# Altium project Qunyin_mmWave_core.PrjPcb (part 1 of 2)
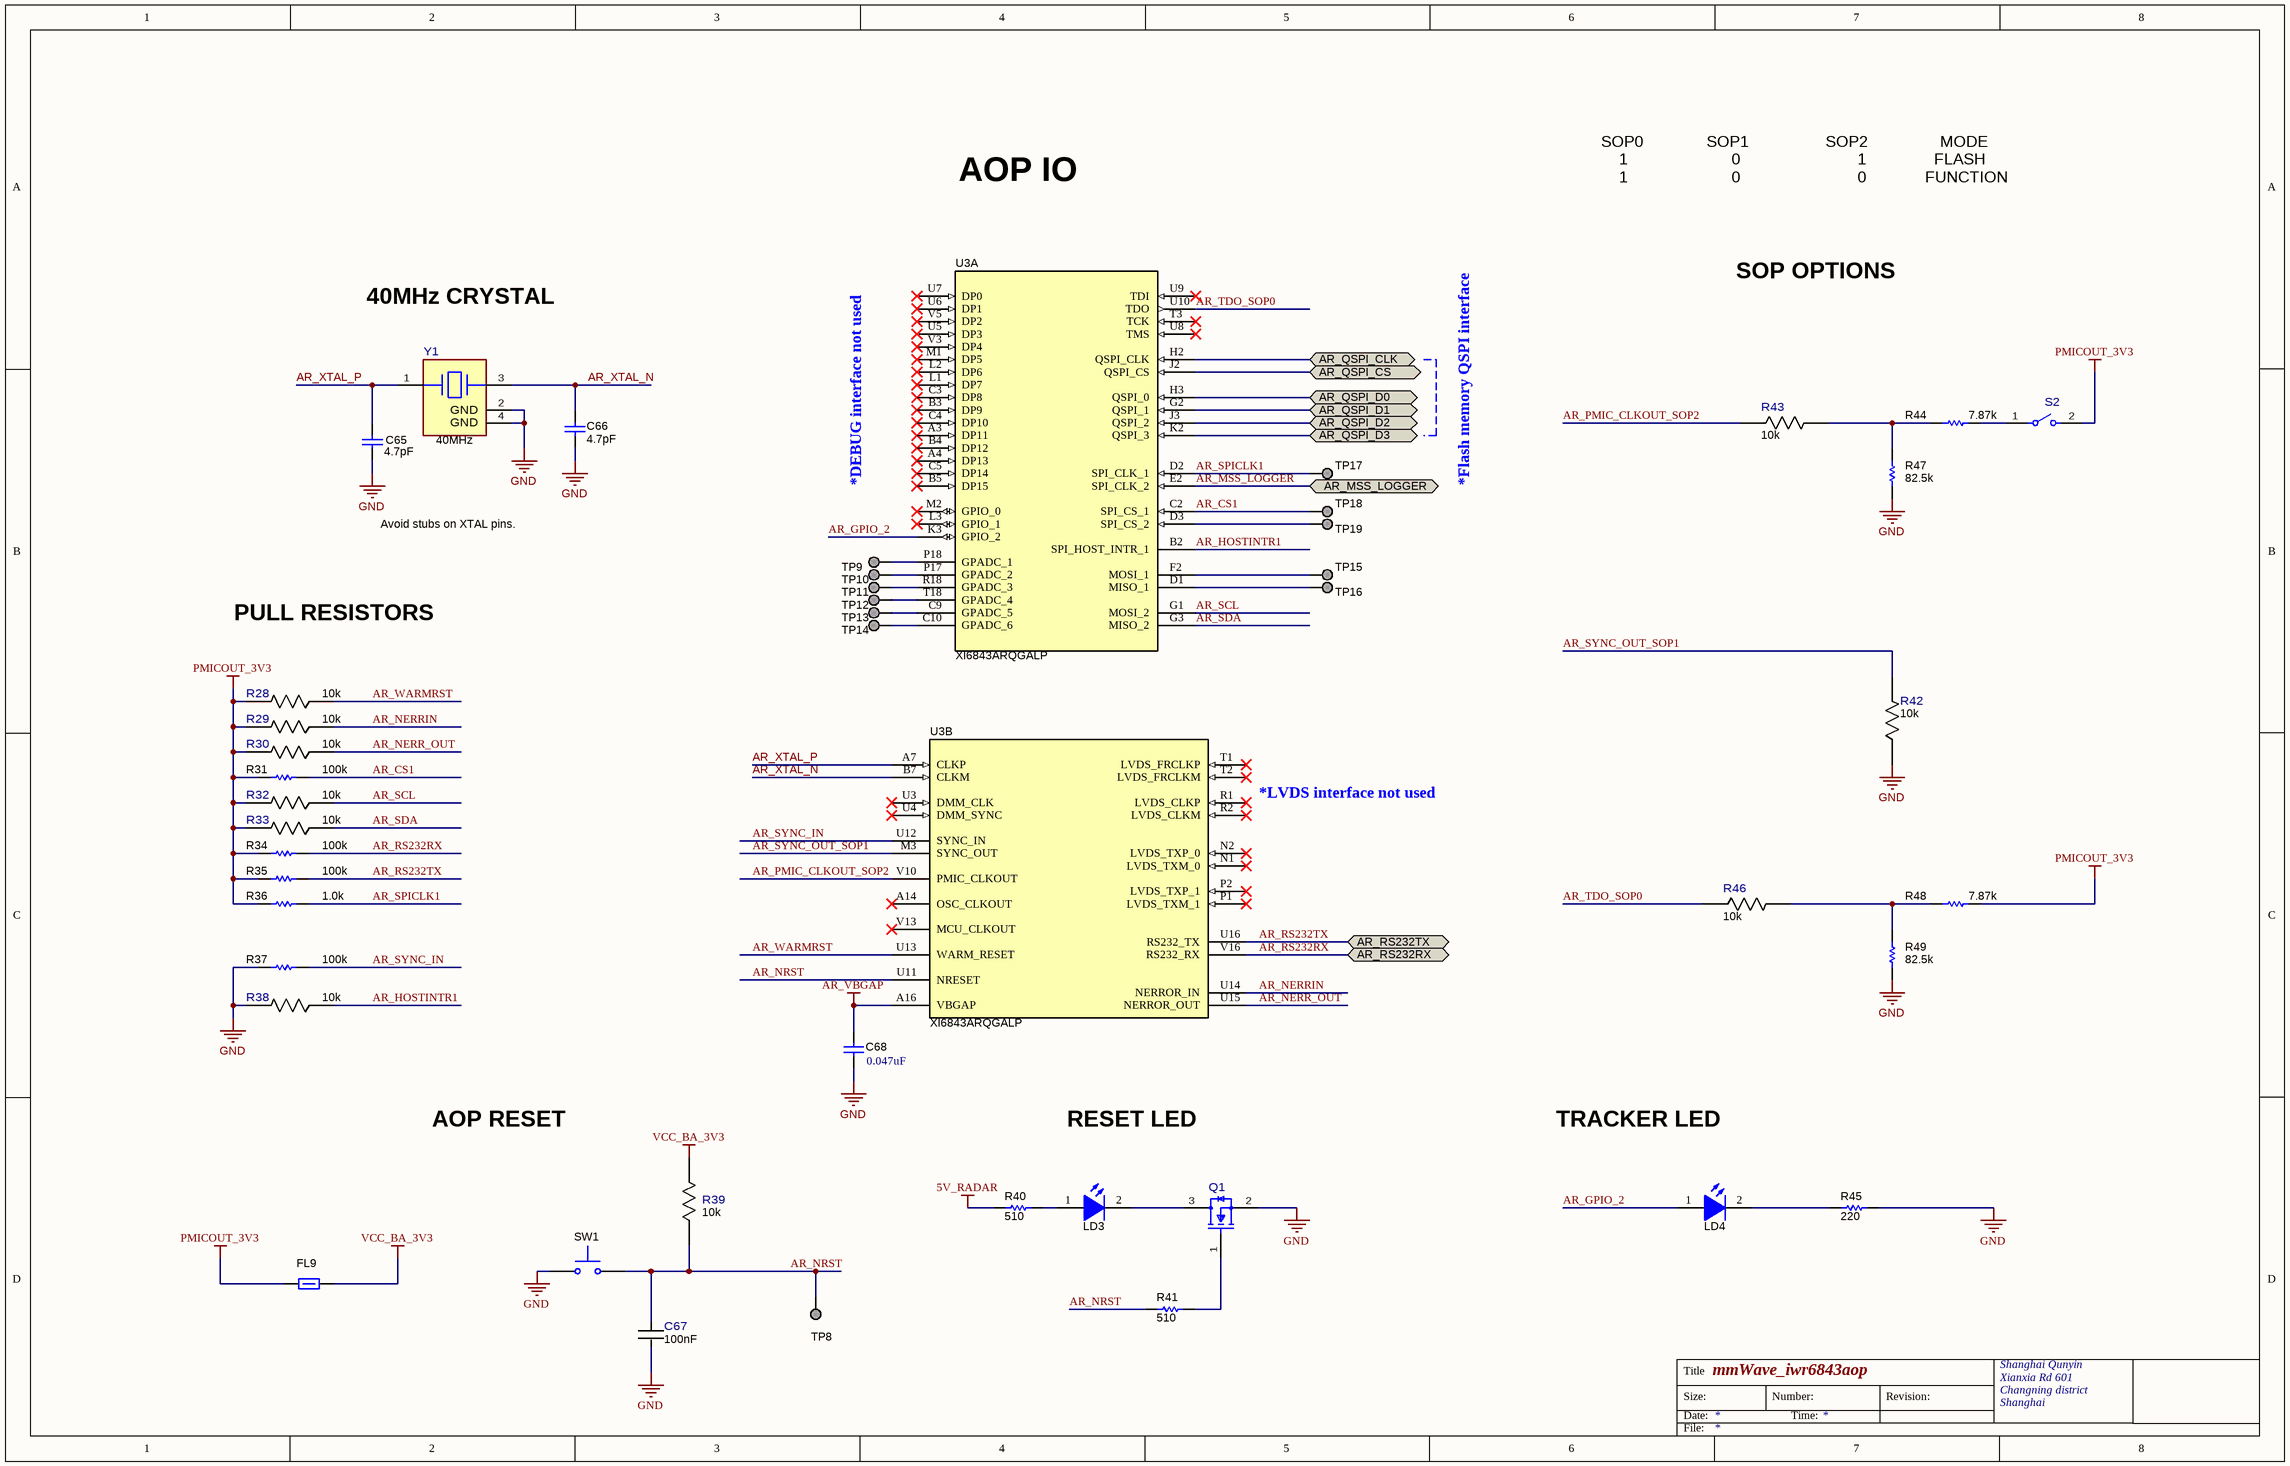
[diagram p0: Qunyin_mmWave_mainIOs.SchDoc]
5 sheets, 195 parts. Net scope: flat (ports and power ports of the same name join across sheets).
Sheets:
  Qunyin_mmWave_mainIOs.SchDoc
  Qunyin_mmWave_mainPowers.SchDoc
  Qunyin_mmWave_pmic.SchDoc
  Qunyin_mmWave_flash&USB.SchDoc
  Qunyin_mmWave_ESP32.SchDoc

## Sheet Qunyin_mmWave_mainIOs.SchDoc: mmWave_iwr6843aop
size 457 x 292 mm; DrawnBy: Wxd; Organization: Shanghai Qunyin; Address1: Xianxia Rd 601; Address2: Changning district; Address3: Shanghai; DocumentNumber: 1; SheetNumber: 1; SheetTotal: 5

### Parts
C65  value 4.7pF  [0201_033L]  (hidden comment: GRM0335C1H4R7BA01D)
C66  value 4.7pF  [0201_033L]  (hidden comment: GRM0335C1H4R7BA01D)
C67  Cap_F: 100nF  [FP-GRM033R6YA104KE14D_0201 (0603 Metric)-IPC_C]  (hidden comment: GRM033R6YA104KE14D)
C68  ValueDisplayed: 0.047uF  [0201_033L]  (hidden comment: GRM033R61C473KE84D)
FL9  BLM15PD300SZ1D  [0402L]  (value not drawn)
LD3  APHHS1005CGCK  [APHHS1005_Green]  (value not drawn)
LD4  APHHS1005CGCK  [APHHS1005_Green]  (value not drawn)
Q1  BSS123-7-F  [FP-BSS123-7-F_SOT23-IPC_C]  (value not drawn)
R28  Res_ohm: 10k  [FP-RR0306P-103-D_0201-IPC_C]  (hidden comment: RR0306P-103-D)
R29  Res_ohm: 10k  [FP-RR0306P-103-D_0201-IPC_C]  (hidden comment: RR0306P-103-D)
R30  Res_ohm: 10k  [FP-RR0306P-103-D_0201-IPC_C]  (hidden comment: RR0306P-103-D)
R31  value 100k  [0201L]  (hidden comment: CRCW0201100KFKED)
R32  Res_ohm: 10k  [FP-RR0306P-103-D_0201-IPC_C]  (hidden comment: RR0306P-103-D)
R33  Res_ohm: 10k  [FP-RR0306P-103-D_0201-IPC_C]  (hidden comment: RR0306P-103-D)
R34  value 100k  [0201L]  (hidden comment: CRCW0201100KFKED)
R35  value 100k  [0201L]  (hidden comment: CRCW0201100KFKED)
R36  value 1.0k  [0201L]  (hidden comment: RC0201JR-071KL)
R37  value 100k  [0201L]  (hidden comment: CRCW0201100KFKED)
R38  Res_ohm: 10k  [FP-RR0306P-103-D_0201-IPC_C]  (hidden comment: RR0306P-103-D)
R39  Res_ohm: 10k  [FP-RR0306P-103-D_0201-IPC_C]  (hidden comment: RR0306P-103-D)
R40  value 510  [0201L]  (hidden comment: RC0201JR-07510RL)
R41  value 510  [0201L]  (hidden comment: RC0201JR-07510RL)
R42  Res_ohm: 10k  [FP-RR0306P-103-D_0201-IPC_C]  (hidden comment: RR0306P-103-D)
R43  Res_ohm: 10k  [FP-RR0306P-103-D_0201-IPC_C]  (hidden comment: RR0306P-103-D)
R44  value 7.87k  [0201L]  (hidden comment: RC0201FR-077K87L)
R45  value 220  [0201L]  (hidden comment: RC0201JR-07220RL)
R46  Res_ohm: 10k  [FP-RR0306P-103-D_0201-IPC_C]  (hidden comment: RR0306P-103-D)
R47  value 82.5k  [0201L]  (hidden comment: RC0201FR-0782K5L)
R48  value 7.87k  [0201L]  (hidden comment: RC0201FR-077K87L)
R49  value 82.5k  [0201L]  (hidden comment: RC0201FR-0782K5L)
S2  CHS-01TA  [FP-CHS-01TA_SMT_SW_5MM4_2MM5-MFG]  (value not drawn)
SW1  B3U-1000P  [SW_B3U-1000P]  (value not drawn)
TP8  TESTPOINT  [TP_25MIL-SMT]  (value not drawn)  (no BOM)
TP9  TESTPOINT  [TP_25MIL-SMT]  (value not drawn)  (no BOM)
TP10  TESTPOINT  [TP_25MIL-SMT]  (value not drawn)  (no BOM)
TP11  TESTPOINT  [TP_25MIL-SMT]  (value not drawn)  (no BOM)
TP12  TESTPOINT  [TP_25MIL-SMT]  (value not drawn)  (no BOM)
TP13  TESTPOINT  [TP_25MIL-SMT]  (value not drawn)  (no BOM)
TP14  TESTPOINT  [TP_25MIL-SMT]  (value not drawn)  (no BOM)
TP15  TESTPOINT  [TP_25MIL-SMT]  (value not drawn)  (no BOM)
TP16  TESTPOINT  [TP_25MIL-SMT]  (value not drawn)  (no BOM)
TP17  TESTPOINT  [TP_25MIL-SMT]  (value not drawn)  (no BOM)
TP18  TESTPOINT  [TP_25MIL-SMT]  (value not drawn)  (no BOM)
TP19  TESTPOINT  [TP_25MIL-SMT]  (value not drawn)  (no BOM)
U3  XI6843ARQGALP  [ALP0180A]  (parts A,B of 4)
Y1  Frequency_Fixed: 40MHz  [FP-CX2016DB40000D0FLJCC_SMT_2MM0_1MM6-MFG]  (hidden comment: CX2016DB40000D0FLJCC)

### Ports
AR_MSS_LOGGER (bidir), AR_QSPI_CLK (bidir), AR_QSPI_CS (bidir), AR_QSPI_D0 (bidir), AR_QSPI_D1 (bidir), AR_QSPI_D2 (bidir), AR_QSPI_D3 (bidir), AR_RS232RX (bidir), AR_RS232TX (bidir)

### Nets
5V_RADAR: R40.1
AR_VBGAP: C68.1 U3.A16(VBGAP)
GND: C65.1 C66.1 C67.2 C68.2 Q1.2(S) R37.1 R38.2 R42.1 R45.1 R47.1 R49.1 SW1.2 Y1.2(GND) Y1.4(GND)  [project net AGND]
PMICOUT_3V3: FL9.1 R28.2 R29.2 R30.2 R31.1 R32.2 R33.2 R34.1 R35.1 R36.1 R48.1 S2.2
VCC_BA_3V3: FL9.2 R39.2
AR_CS1: R31.2 TP18.1 U3.C2(SPI_CS_1)
AR_GPIO_2: LD4.1(A) U3.K3(GPIO_2)
AR_HOSTINTR1: R38.1 U3.B2(SPI_HOST_INTR_1)
AR_MSS_LOGGER: U3.E2(SPI_CLK_2) ; port AR_MSS_LOGGER
AR_NERR_OUT: R30.1 U3.U15(NERROR_OUT)
AR_NERRIN: R29.1 U3.U14(NERROR_IN)
AR_NRST: C67.1 R39.1 R41.1 SW1.1 TP8.1 U3.U11(NRESET)
AR_PMIC_CLKOUT_SOP2: R43.1 U3.V10(PMIC_CLKOUT)
AR_QSPI_CLK: U3.H2(QSPI_CLK) ; port AR_QSPI_CLK
AR_QSPI_CS: U3.J2(QSPI_CS) ; port AR_QSPI_CS
AR_QSPI_D0: U3.H3(QSPI_0) ; port AR_QSPI_D0
AR_QSPI_D1: U3.G2(QSPI_1) ; port AR_QSPI_D1
AR_QSPI_D2: U3.J3(QSPI_2) ; port AR_QSPI_D2
AR_QSPI_D3: U3.K2(QSPI_3) ; port AR_QSPI_D3
AR_RS232RX: R34.2 U3.V16(RS232_RX) ; port AR_RS232RX
AR_RS232TX: R35.2 U3.U16(RS232_TX) ; port AR_RS232TX
AR_SCL: R32.1 U3.G1(MOSI_2)
AR_SDA: R33.1 U3.G3(MISO_2)
AR_SPICLK1: R36.2 TP17.1 U3.D2(SPI_CLK_1)
AR_SYNC_IN: R37.2 U3.U12(SYNC_IN)
AR_SYNC_OUT_SOP1: R42.2 U3.M3(SYNC_OUT)
AR_TDO_SOP0: R46.1 U3.U10(TDO)
AR_WARMRST: R28.1 U3.U13(WARM_RESET)
AR_XTAL_N: C66.2 U3.B7(CLKM) Y1.3
AR_XTAL_P: C65.2 U3.A7(CLKP) Y1.1
NetLD3_1: LD3.1(A) R40.2
NetLD3_2: LD3.2(K) Q1.3(D)
NetLD4_2: LD4.2(K) R45.2
NetQ1_1: Q1.1(G) R41.2
NetR43_2: R43.2 R44.2 R47.2
NetR44_1: R44.1 S2.1
NetR46_2: R46.2 R48.2 R49.2
NetTP9_1: TP9.1 U3.P18(GPADC_1)
NetTP10_1: TP10.1 U3.P17(GPADC_2)
NetTP11_1: TP11.1 U3.R18(GPADC_3)
NetTP12_1: TP12.1 U3.T18(GPADC_4)
NetTP13_1: TP13.1 U3.C9(GPADC_5)
NetTP14_1: TP14.1 U3.C10(GPADC_6)
NetTP15_1: TP15.1 U3.F2(MOSI_1)
NetTP16_1: TP16.1 U3.D1(MISO_1)
NetTP19_1: TP19.1 U3.D3(SPI_CS_2)

Not connected (* = marked no-connect by the designer): U3 A3(DP11)* A4(DP13)* A14(OSC_CLKOUT)* B3(DP9)* B4(DP12)* B5(DP15)* C3(DP8)* C4(DP10)* C5(DP14)* L1(DP7)* L2(DP6)* L3(GPIO_1)* M1(DP5)* M2(GPIO_0)* N1(LVDS_TXM_0)* N2(LVDS_TXP_0)* P1(LVDS_TXM_1)* P2(LVDS_TXP_1)* R1(LVDS_CLKP)* R2(LVDS_CLKM)* T1(LVDS_FRCLKP)* T2(LVDS_FRCLKM)* T3(TCK)* U3(DMM_CLK)* U4(DMM_SYNC)* U5(DP3)* U6(DP1)* U7(DP0)* U8(TMS)* U9(TDI)* V3(DP4)* V5(DP2)* V13(MCU_CLKOUT)*

### Notes on the sheet
- AOP IO
- SOP0              SOP1                 SOP2                MODE
  1                       0                          1               FLASH
  1                       0                          0             FUNCTION
- SOP OPTIONS
- 40MHz CRYSTAL
- Avoid stubs on XTAL pins.
- *DEBUG interface not used
- *Flash memory QSPI interface
- PULL RESISTORS
- *LVDS interface not used
- AOP RESET
- RESET LED
- TRACKER LED
- Title
- Size:
- Date:
- Number:
- Time:
- Revision:
- File:

### Library data of the parts
C65 C66 = CMP-0080076-1: CAP, CERM, 4.7 pF, 50 V,+/- 3%, C0G/NP0, 0201; Manufacturer: MuRata; AEC Category: Q200; AEC Qualified: N; Cap_Case: 0201; SizeArea_mm2: 0.18; SizeAreaWB_mm2: 2.08; SizeX_mm: 0.6; SizeY_mm: 0.3; SizeZ_mm: 0.33; TaMax_C: 125°C; TaMin_C: -55°C; U/M: EA; Value2: 50V; RoHS: Y; AEC Grade: N/A; Cap_F: 4.7pF; ComponentLink1Description: Datasheet link; ComponentLink1URL: https://search.murata.co.jp/Ceramy/image/img/A01X/G101/ENG/GRM0335C1H4R7BA01-01A.pdf; CompType: Capacitor; MountType: SMT; PackageReference: 0201; PartNumber: GRM0335C1H4R7BA01D; Polarized: N; Supplier 1: Digi-Key; Supplier 2: Mouser; Supplier Part Number 1: 490-11332-1-ND; Supplier Part Number 2: 81-GRM0335C1H4R7BA1D; Technology: Ceramic; TempCo: C0G/NP0; Tolerance_%: 3%; ValueDisplayed: 4.7pF; VDC_V: 50V
C67 = CMP-0086440-1: Cap Ceramic 0.1uF 35V X5R 10% Pad SMD 0201 85C T/R; Manufacturer: Murata Electronics North America; AEC Qualified: No; SizeZ_mm: 0.33mm; Symbol Name: SYM-GRM033R6YA104KE14D; TempCo: 15%; RoHS: TRUE; ComponentLink1Description: Datasheet; ComponentLink1URL: https://search.murata.co.jp/Ceramy/image/img/A01X/G101/ENG/GRM033R6YA104KE14-01.pdf; PackageReference: 0201 (0603 Metric); PartNumber: GRM033R6YA104KE14D; Tolerance_%: 10%; VDC_V: 35V
C68 = CMP-0009718-2: CAP, CERM, 0.047 uF, 16 V, +/- 10%, X5R, 0201; Manufacturer: MuRata; TaMin_C: -55°C; Polarized: N; SizeAreaWB_mm2: 2.08; Value1: Unknown; U/M: EA; TaMax_C: 85°C; SizeZ_mm: 0.33; SizeX_mm: 0.6; SizeY_mm: 0.3; Cap_Case: 0201; Value2: 16V; SizeArea_mm2: 0.18; Cap_F: 47nF; AEC Category: Q200; Supplier Part Number 2: 81-GRM033R61C473KE4D; Publisher: Texas Instruments; Supplier 2: Mouser; TempCo: X5R; Published: 2008-06-19; RoHS: Y; MountType: SMT; Value: 0.047uF; Supplier 1: Digi-Key; PackageReference: 0201; Tolerance_%: 10%; CompType: Capacitor; LatestRevisionDate: 2017-03-09; PartNumber: GRM033R61C473KE84D; AEC Qualified: N; VDC_V: 16V; ComponentLink1Description: Datasheet link; AEC Grade: N/A; Supplier Part Number 1: 490-7227-1-ND; Technology: Ceramic; ComponentLink1URL: http://search.murata.co.jp/Ceramy/image/img/A01X/G101/ENG/GRM033R61C473KE84-01.pdf
FL9 = CMP-0078934-1: Inductor, Ferrite Bead, Ferrite, 2.2 A, 0.035 ohm, AEC-Q200 Grade 1, SMD; Manufacturer: MuRata; AEC Category: Q200; AEC Grade: 1; AEC Qualified: Y; DCR_ohm: 0.035; Imax_A: 2.2A; SizeArea_mm2: 0.5; SizeAreaWB_mm2: 3; SizeZ_mm: 0.6; RoHS: Y; ComponentLink1Description: Datasheet link; ComponentLink1URL: https://www.murata.com/en-us/products/productdata/8796748677150/QNFA9118.pdf; CompType: Inductor; LatestRevisionDate: 2017-12-07; Material: Ferrite; MountType: SMT; PackageReference: 0402; PartNumber: BLM15PD300SZ1D; Published: 2008-06-26; Publisher: Texas Instruments; SizeX_mm: 1; SizeY_mm: 0.5; Supplier 1: Digi-Key; Supplier 2: Mouser; Supplier Part Number 1: 490-16506-1-ND; Supplier Part Number 2: 81-BLM15PD300SZ1D; Technology: Ferrite Bead; Value1: 0.035 ohm; Value2: 2.2A
LD3 LD4 = CMP-0067682-2: LED, Green, SMD; Manufacturer: Kingbright; Angle: 120.0; Power_TotalModule: 75mW; SizeZ_mm: 0.6; Vf_V: 2.1V; Vr_V: 5V; Io_A: 20mA; Ir_A: 10µA; SizeArea_mm2: 0.5; SizeAreaWB_mm2: 3.0; SizeX_mm: 1.0; Tjmax_C: 85°C; Value1: 0.075W; RoHS: Y; Color: Green; ComponentLink1Description: Datasheet link; ComponentLink1URL: http://www.kingbrightusa.com/images/catalog/SPEC/APHHS1005CGCK.pdf; PackageReference: 0402; PartNumber: APHHS1005CGCK; CompType: LED; MountType: SMT; SizeY_mm: 0.5; Type: ?; Value2: 2.1V; Value: Green
Q1 = CMP-0087176-1: MOSFET N-CH 100V 170MA SOT23-3; Manufacturer: Diodes Incorporated; AEC Qualified: No; ChMode: False; Rdson45_ohm: 6; SizeZ_mm: 1.1mm; Vgs_V: 20V; RoHS: TRUE; ComponentLink1Description: Datasheet; ComponentLink1URL: https://www.diodes.com/assets/Datasheets/ds30366.pdf; IdsMax_A: 170mA; PackageReference: SOT23; PartNumber: BSS123-7-F; Symbol Name: SYM-BSS123-7-F; VdsMax_V: 100V
R28-R30 R32 R33 R38 R39 R42 R43 R46 = CMP-0088002-1: 10 kOhms ±0.5% 0.05W, 1/20W Chip Resistor 0201 (0603 Metric)  Thin Film; Manufacturer: Susumu; AEC Qualified: No; Power_W: 50mW; SizeZ_mm: 0.26mm; Symbol Name: SYM-RR0306P-103-D; TempCo: 25ppm/°C; VDC_V: 15V; RoHS: TRUE; ComponentLink1Description: Datasheet; ComponentLink1URL: https://www.susumu.co.jp/common/pdf/n_catalog_partition05_en.pdf; PackageReference: 0201; PartNumber: RR0306P-103-D; Technology: Thin Film; Tolerance_%: 0.5%
R31 R34 R35 R37 = CMP-0027261-3: RES, 100 k, 1%, 0.05 W, 0201; Manufacturer: Vishay-Dale; AEC Category: Q200; AEC Qualified: N; EIA_Code: E96; Power_W: 50mW; SizeArea_mm2: 0.18; SizeX_mm: 0.6; SizeY_mm: 0.3; SizeZ_mm: 0.26; TempCo: 100 ppm/C; Value2: 0.05W; VDC_V: 30V; RoHS: E; AEC Grade: N/A; ComponentLink1Description: Datasheet link; ComponentLink1URL: http://www.vishay.com/docs/20052/crcw0201e3.pdf; CompType: Resistor; MountType: SMT; PackageReference: 0201; PartNumber: CRCW0201100KFKED; Res_ohm: 100k; Supplier 1: Digi-Key; Supplier 2: Newark; Supplier 3: Mouser; Supplier Part Number 1: 541-100KAABCT-ND; Supplier Part Number 2: 84R1457; Supplier Part Number 3: 71-CRCW0201100KFKED; Technology: Thick Film; Tolerance_%: 1%; Value1: 1%; Value_Code: 100k; ValueDisplayed: 100k
R36 = CMP-0027052-1: RES, 1.0 k, 5%, 0.05 W, 0201; Manufacturer: Yageo America; AEC Category: Q200; AEC Qualified: N; EIA_Code: E24; Power_W: 50mW; Res_ohm: 1k; SizeArea_mm2: 0.18; SizeX_mm: 0.6; SizeY_mm: 0.3; SizeZ_mm: 0.26; TempCo: 200 ppm/C; U/M: EA; Value2: 0.05W; Value_Code: 1k00; VDC_V: 25V; RoHS: Y; AEC Grade: N/A; ComponentLink1Description: Datasheet link; ComponentLink1URL: http://www.yageo.com/documents/recent/PYu-RC_Group_51_RoHS_L_5.pdf; CompType: Resistor; LatestRevisionDate: 2017-03-09; MountType: SMT; PackageReference: 0201; PartNumber: RC0201JR-071KL; Published: 2016-10-14; Publisher: Texas Instruments; Supplier 1: Digi-Key; Supplier 2: Mouser; Supplier Part Number 1: 311-1KNCT-ND; Supplier Part Number 2: 603-RC0201JR-071KL; Technology: Thick Film; Tolerance_%: 5%; Value1: 5%; ValueDisplayed: 1.0k
R40 R41 = CMP-0027137-1: RES, 510, 5%, 0.05 W, 0201; Manufacturer: Yageo America; AEC Category: Q200; AEC Qualified: N; EIA_Code: E24; Power_W: 50mW; SizeArea_mm2: 0.18; SizeX_mm: 0.6; SizeY_mm: 0.3; SizeZ_mm: 0.26; TempCo: 200 ppm/C; U/M: EA; Value2: 0.05W; Value_Code: 510R; VDC_V: 25V; RoHS: Y; AEC Grade: N/A; ComponentLink1Description: Datasheet link; ComponentLink1URL: http://www.yageo.com/documents/recent/PYu-RC_Group_51_RoHS_L_5.pdf; CompType: Resistor; LatestRevisionDate: 2017-03-09; MountType: SMT; PackageReference: 0201; PartNumber: RC0201JR-07510RL; Published: 2016-10-14; Publisher: Texas Instruments; Res_ohm: 510; Supplier 1: Digi-Key; Supplier 2: Mouser; Supplier Part Number 1: YAG2907CT-ND; Supplier Part Number 2: 603-RC0201JR-07510RL; Technology: Thick Film; Tolerance_%: 5%; Value1: 5%; ValueDisplayed: 510
R44 R48 = CMP-0027880-1: RES, 7.87 k, 1%, 0.05 W, 0201; Manufacturer: Yageo America; AEC Category: Q200; AEC Qualified: N; EIA_Code: E96; Power_W: 50mW; SizeArea_mm2: 0.18; SizeX_mm: 0.6; SizeY_mm: 0.3; SizeZ_mm: 0.26; TempCo: 200 ppm/C; U/M: EA; Value2: 0.05W; Value_Code: 7k87; VDC_V: 25V; RoHS: Y; AEC Grade: N/A; ComponentLink1Description: Datasheet link; ComponentLink1URL: http://www.yageo.com/documents/recent/PYu-RC_Group_51_RoHS_L_5.pdf; CompType: Resistor; LatestRevisionDate: 2017-03-09; MountType: SMT; PackageReference: 0201; PartNumber: RC0201FR-077K87L; Published: 2016-10-14; Publisher: Texas Instruments; Res_ohm: 7.87k; Supplier 1: Digi-Key; Supplier 2: Mouser; Supplier Part Number 1: YAG2807CT-ND; Supplier Part Number 2: 603-RC0201FR-077K87L; Technology: Thick Film; Tolerance_%: 1%; Value1: 1%; ValueDisplayed: 7.87k
R45 = CMP-0027072-1: RES, 220, 5%, 0.05 W, 0201; Manufacturer: Yageo America; AEC Category: Q200; AEC Qualified: N; EIA_Code: E24; Power_W: 50mW; SizeArea_mm2: 0.18; SizeX_mm: 0.6; SizeY_mm: 0.3; SizeZ_mm: 0.26; TempCo: 200 ppm/C; U/M: EA; Value2: 0.05W; Value_Code: 220R; VDC_V: 25V; RoHS: Y; AEC Grade: N/A; ComponentLink1Description: Datasheet link; ComponentLink1URL: http://www.yageo.com/documents/recent/PYu-RC_Group_51_RoHS_L_5.pdf; CompType: Resistor; LatestRevisionDate: 2017-03-09; MountType: SMT; PackageReference: 0201; PartNumber: RC0201JR-07220RL; Published: 2016-10-14; Publisher: Texas Instruments; Res_ohm: 220; Supplier 1: Digi-Key; Supplier 2: Mouser; Supplier Part Number 1: 311-220NCT-ND; Supplier Part Number 2: 603-RC0201JR-07220RL; Technology: Thick Film; Tolerance_%: 5%; Value1: 5%; ValueDisplayed: 220
R47 R49 = CMP-0027891-1: RES, 82.5 k, 1%, 0.05 W, 0201; Manufacturer: Yageo America; AEC Category: Q200; AEC Qualified: N; EIA_Code: E96; Power_W: 50mW; SizeArea_mm2: 0.18; SizeX_mm: 0.6; SizeY_mm: 0.3; SizeZ_mm: 0.26; TempCo: 200 ppm/C; U/M: EA; Value2: 0.05W; Value_Code: 82k5; VDC_V: 25V; RoHS: Y; AEC Grade: N/A; ComponentLink1Description: Datasheet link; ComponentLink1URL: http://www.yageo.com/documents/recent/PYu-RC_Group_51_RoHS_L_5.pdf; CompType: Resistor; LatestRevisionDate: 2017-03-09; MountType: SMT; PackageReference: 0201; PartNumber: RC0201FR-0782K5L; Published: 2016-10-14; Publisher: Texas Instruments; Res_ohm: 82.5k; Supplier 1: Digi-Key; Supplier 2: Mouser; Supplier Part Number 1: YAG2815CT-ND; Supplier Part Number 2: 603-RC0201FR-0782K5L; Technology: Thick Film; Tolerance_%: 1%; Value1: 1%; ValueDisplayed: 82.5k
S2 = CMP-0087181-1: SWITCH SLIDE DIP SPST 100MA 6V; Manufacturer: Nidec Copal Electronics; PositionCount: 1; SizeZ_mm: 2.5mm; Symbol Name: SYM-CHS-01TA; RoHS: TRUE; Circuit: SPST; ComponentLink1Description: Datasheet; ComponentLink1URL: https://www.nidec-copal-electronics.com/e/catalog/switch/chs.pdf; MountType: Surface Mount; PackageReference: SMT_SW_5MM4_2MM5; PartNumber: CHS-01TA; VDC_V: 6V
SW1 = CMP-0002150-2: SWITCH TACTILE SPST-NO 0.05A 12V; Manufacturer: Omron Electronic Components; CurrentRating_mA: 50A; PositionCount: 1; SwitchFunction: Off-Mom; RoHS: Y; Circuit: SPST-NO; ComponentLink1Description: Datasheet URL; ComponentLink1URL: http://www.components.omron.com/components/web/PDFLIB.nsf/0/2DD3893C7DD33E9E862572900079E9D6/$file/B3U_1110.pdf; CompType: Switch; LatestRevisionDate: 2017-03-09; MountType: SMT; Orientation: Top Actuated; PackageReference: 3x1.6x2.5mm; PartNumber: B3U-1000P; Publisher: Texas Instruments; Supplier 1: Digi-Key; Supplier 2: Newark; Supplier 3: Mouser; Supplier Part Number 1: SW1020CT-ND; Supplier Part Number 2: 34M5295; Supplier Part Number 3: 653-B3U-1000P; VDC_V: 12V
TP8-TP19 = CMP-0078143-3: TEST POINT.  No entry in BOM.; CompType: Testpoint; Manufacturer: N/A; PackageReference: N/A; PartNumber: N/A; Library Reference: TESTPOINT
U3 = CMP-0860942-2: XI6843ARQGALP, ALP0180A (BGA-180); Manufacturer: Texas Instruments; SizeZ_mm: 0.965; SizeX_mm: 15; AEC Qualified: N; SizeArea_mm2: 225; SizeAreaWB_mm2: 289; CompType: IC; AEC Category: Q200; MountType: SMT; ComponentLink2URL: http://www.ti.com/product/xi6843arqg; Alternate Manufacturer: Texas Instruments; ComponentLink2Description: Product Folder; ComponentLink3Description: Online Datasheet; PackageReference: ALP0180A; ComponentLink1URL: http://www.ti.com/lit/ds/symlink/xi6843arqg.pdf; PartNumber: XI6843ARQGALP; PackageDescription: BGA-180; ComponentLink1Description: Datasheet Link; ComponentLink3URL: http://www.ti.com/product/xi6843arqg/datasheet; SizeY_mm: 15
Y1 = CMP-0087164-1: CRYSTAL 40.0000MHZ 8PF SMD; Manufacturer: Kyocera International Inc. Electronic Components; AEC Qualified: No; Frequency Stability: 15ppm; SizeZ_mm: 0.45mm; RoHS: TRUE; ComponentLink1Description: Datasheet; ComponentLink1URL: https://global.kyocera.com/prdct/electro/product/pdf/cx2016db_e.pdf; Frequency Tolerance: 15ppm; Load Capacitance: 8pF; PackageReference: SMT_2MM0_1MM6; PartNumber: CX2016DB40000D0FLJCC; Symbol Name: SYM-CX2016DB40000D0FLJCC

## Sheet Qunyin_mmWave_mainPowers.SchDoc: mmWave_iwr6843aop
size 457 x 292 mm; DrawnBy: Wxd; Organization: Shanghai Qunyin; Address1: Xianxia Rd 601; Address2: Changning district; Address3: Shanghai; DocumentNumber: 2; SheetNumber: 2; SheetTotal: 6
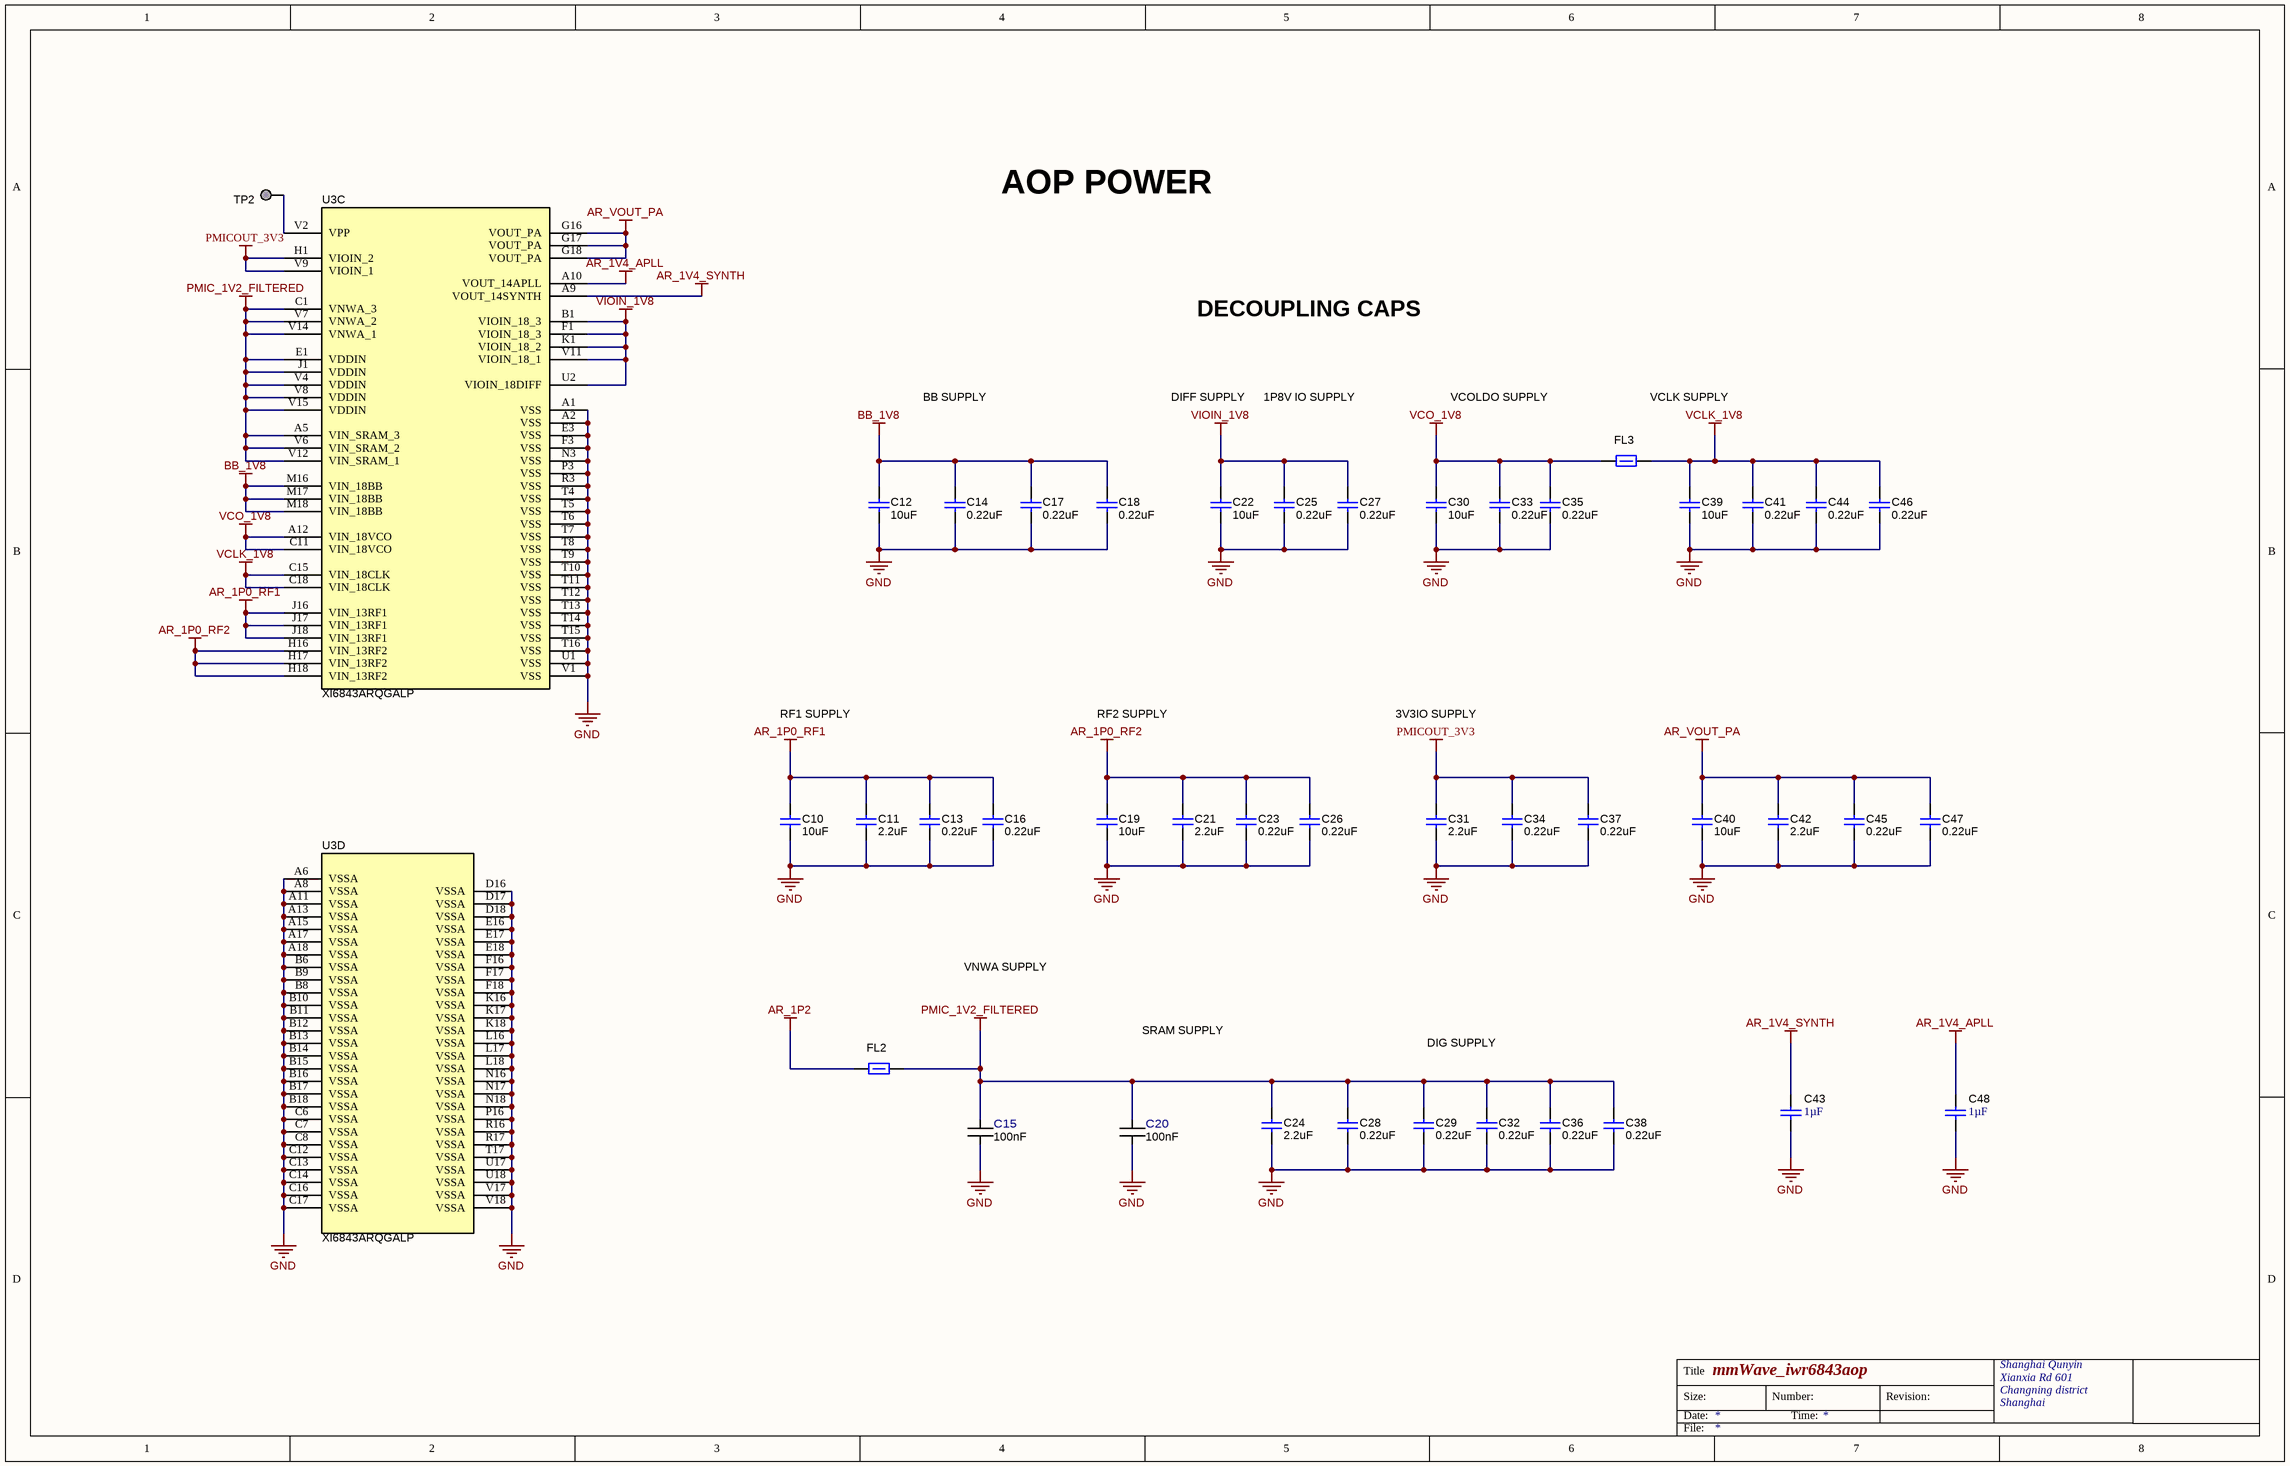
[diagram p1: Qunyin_mmWave_mainPowers.SchDoc]

### Parts
C10  value 10uF  [0402_070]  (hidden comment: CL05A106MP5NUNC)
C11  value 2.2uF  [0201L]  (hidden comment: CL03A225MQ3CRNC)
C12  value 10uF  [0402_070]  (hidden comment: CL05A106MP5NUNC)
C13  value 0.22uF  [0201_033L]  (hidden comment: LMK063BJ224MP-F)
C14  value 0.22uF  [0201_033L]  (hidden comment: LMK063BJ224MP-F)
C15  Cap_F: 100nF  [FP-GRM033R6YA104KE14D_0201 (0603 Metric)-IPC_C]  (hidden comment: GRM033R6YA104KE14D)
C16  value 0.22uF  [0201_033L]  (hidden comment: LMK063BJ224MP-F)
C17  value 0.22uF  [0201_033L]  (hidden comment: LMK063BJ224MP-F)
C18  value 0.22uF  [0201_033L]  (hidden comment: LMK063BJ224MP-F)
C19  value 10uF  [0402_070]  (hidden comment: CL05A106MP5NUNC)
C20  Cap_F: 100nF  [FP-GRM033R6YA104KE14D_0201 (0603 Metric)-IPC_C]  (hidden comment: GRM033R6YA104KE14D)
C21  value 2.2uF  [0201L]  (hidden comment: CL03A225MQ3CRNC)
C22  value 10uF  [0402_070]  (hidden comment: CL05A106MP5NUNC)
C23  value 0.22uF  [0201_033L]  (hidden comment: LMK063BJ224MP-F)
C24  value 2.2uF  [0201L]  (hidden comment: CL03A225MQ3CRNC)
C25  value 0.22uF  [0201_033L]  (hidden comment: LMK063BJ224MP-F)
C26  value 0.22uF  [0201_033L]  (hidden comment: LMK063BJ224MP-F)
C27  value 0.22uF  [0201_033L]  (hidden comment: LMK063BJ224MP-F)
C28  value 0.22uF  [0201_033L]  (hidden comment: LMK063BJ224MP-F)
C29  value 0.22uF  [0201_033L]  (hidden comment: LMK063BJ224MP-F)
C30  value 10uF  [0402_070]  (hidden comment: CL05A106MP5NUNC)
C31  value 2.2uF  [0201L]  (hidden comment: CL03A225MQ3CRNC)
C32  value 0.22uF  [0201_033L]  (hidden comment: LMK063BJ224MP-F)
C33  value 0.22uF  [0201_033L]  (hidden comment: LMK063BJ224MP-F)
C34  value 0.22uF  [0201_033L]  (hidden comment: LMK063BJ224MP-F)
C35  value 0.22uF  [0201_033L]  (hidden comment: LMK063BJ224MP-F)
C36  value 0.22uF  [0201_033L]  (hidden comment: LMK063BJ224MP-F)
C37  value 0.22uF  [0201_033L]  (hidden comment: LMK063BJ224MP-F)
C38  value 0.22uF  [0201_033L]  (hidden comment: LMK063BJ224MP-F)
C39  value 10uF  [0402_070]  (hidden comment: CL05A106MP5NUNC)
C40  value 10uF  [0402_070]  (hidden comment: CL05A106MP5NUNC)
C41  value 0.22uF  [0201_033L]  (hidden comment: LMK063BJ224MP-F)
C42  value 2.2uF  [0201L]  (hidden comment: CL03A225MQ3CRNC)
C43  ValueDisplayed: 1µF  [0402L]  (hidden comment: CGB2A1X6S0J105K033BC)
C44  value 0.22uF  [0201_033L]  (hidden comment: LMK063BJ224MP-F)
C45  value 0.22uF  [0201_033L]  (hidden comment: LMK063BJ224MP-F)
C46  value 0.22uF  [0201_033L]  (hidden comment: LMK063BJ224MP-F)
C47  value 0.22uF  [0201_033L]  (hidden comment: LMK063BJ224MP-F)
C48  ValueDisplayed: 1µF  [0402L]  (hidden comment: CGB2A1X6S0J105K033BC)
FL2  BLM15PD300SZ1D  [0402L]  (value not drawn)
FL3  BLM15PD300SZ1D  [0402L]  (value not drawn)
TP2  TESTPOINT  [TP_25MIL-SMT]  (value not drawn)  (no BOM)
U3  XI6843ARQGALP  [ALP0180A]  (parts C,D of 4)

### Nets
AR_1P0_RF1: C10.1 C11.1 C13.1 C16.1 U3.J16(VIN_13RF1) U3.J17(VIN_13RF1) U3.J18(VIN_13RF1)
AR_1P0_RF2: C19.1 C21.1 C23.1 C26.1 U3.H16(VIN_13RF2) U3.H17(VIN_13RF2) U3.H18(VIN_13RF2)
AR_1P2: FL2.1
AR_1V4_APLL: C48.1 U3.A10(VOUT_14APLL)
AR_1V4_SYNTH: C43.1 U3.A9(VOUT_14SYNTH)
AR_VOUT_PA: C40.1 C42.1 C45.1 C47.1 U3.G16(VOUT_PA) U3.G17(VOUT_PA) U3.G18(VOUT_PA)
BB_1V8: C12.1 C14.1 C17.1 C18.1 U3.M16(VIN_18BB) U3.M17(VIN_18BB) U3.M18(VIN_18BB)
GND: C10.2 C11.2 C12.2 C13.2 C14.2 C15.2 C16.2 C17.2 C18.2 C19.2 C20.2 C21.2 C22.2 C23.2 C24.2 C25.2 C26.2 C27.2 C28.2 C29.2 C30.2 C31.2 C32.2 C33.2 C34.2 C35.2 C36.2 C37.2 C38.2 C39.2 C40.2 C41.2 C42.2 C43.2 C44.2 C45.2 C46.2 C47.2 C48.2 U3.A1(VSS) U3.A2(VSS) U3.A6(VSSA) U3.A8(VSSA) U3.A11(VSSA) U3.A13(VSSA) U3.A15(VSSA) U3.A17(VSSA) U3.A18(VSSA) U3.B6(VSSA) U3.B8(VSSA) U3.B9(VSSA) U3.B10(VSSA) U3.B11(VSSA) U3.B12(VSSA) U3.B13(VSSA) U3.B14(VSSA) U3.B15(VSSA) U3.B16(VSSA) U3.B17(VSSA) U3.B18(VSSA) U3.C6(VSSA) U3.C7(VSSA) U3.C8(VSSA) U3.C12(VSSA) U3.C13(VSSA) U3.C14(VSSA) U3.C16(VSSA) U3.C17(VSSA) U3.D16(VSSA) U3.D17(VSSA) U3.D18(VSSA) U3.E3(VSS) U3.E16(VSSA) U3.E17(VSSA) U3.E18(VSSA) U3.F3(VSS) U3.F16(VSSA) U3.F17(VSSA) U3.F18(VSSA) U3.K16(VSSA) U3.K17(VSSA) U3.K18(VSSA) U3.L16(VSSA) U3.L17(VSSA) U3.L18(VSSA) U3.N3(VSS) U3.N16(VSSA) U3.N17(VSSA) U3.N18(VSSA) U3.P3(VSS) U3.P16(VSSA) U3.R3(VSS) U3.R16(VSSA) U3.R17(VSSA) U3.T4(VSS) U3.T5(VSS) U3.T6(VSS) U3.T7(VSS) U3.T8(VSS) U3.T9(VSS) U3.T10(VSS) U3.T11(VSS) U3.T12(VSS) U3.T13(VSS) U3.T14(VSS) U3.T15(VSS) U3.T16(VSS) U3.T17(VSSA) U3.U1(VSS) U3.U17(VSSA) U3.U18(VSSA) U3.V1(VSS) U3.V17(VSSA) U3.V18(VSSA)  [project net AGND]
PMIC_1V2_FILTERED: C15.1 C20.1 C24.1 C28.1 C29.1 C32.1 C36.1 C38.1 FL2.2 U3.A5(VIN_SRAM_3) U3.C1(VNWA_3) U3.E1(VDDIN) U3.J1(VDDIN) U3.V4(VDDIN) U3.V6(VIN_SRAM_2) U3.V7(VNWA_2) U3.V8(VDDIN) U3.V12(VIN_SRAM_1) U3.V14(VNWA_1) U3.V15(VDDIN)
PMICOUT_3V3: C31.1 C34.1 C37.1 U3.H1(VIOIN_2) U3.V9(VIOIN_1)
VCLK_1V8: C39.1 C41.1 C44.1 C46.1 FL3.2 U3.C15(VIN_18CLK) U3.C18(VIN_18CLK)
VCO_1V8: C30.1 C33.1 C35.1 FL3.1 U3.A12(VIN_18VCO) U3.C11(VIN_18VCO)
VIOIN_1V8: C22.1 C25.1 C27.1 U3.B1(VIOIN_18_3) U3.F1(VIOIN_18_3) U3.K1(VIOIN_18_2) U3.U2(VIOIN_18DIFF) U3.V11(VIOIN_18_1)
NetTP2_1: TP2.1 U3.V2(VPP)

### Notes on the sheet
- AOP POWER
- DECOUPLING CAPS
- BB SUPPLY
- DIFF SUPPLY
- 1P8V IO SUPPLY
- VCOLDO SUPPLY
- VCLK SUPPLY
- RF1 SUPPLY
- RF2 SUPPLY
- 3V3IO SUPPLY
- VNWA SUPPLY
- SRAM SUPPLY
- DIG SUPPLY
- Title
- Size:
- Date:
- Number:
- Time:
- Revision:
- File:

### Library data of the parts
C10 C12 C19 C22 C30 C39 C40 = CMP-0006339-4: CAP, CERM, 10 uF, 10 V, +/- 20%, X5R, 0402; Manufacturer: Samsung Electro-Mechanics; AEC Category: Q200; AEC Qualified: N; Cap_Case: 0402; Cap_F: 10µF; SizeArea_mm2: 0.5; SizeAreaWB_mm2: 3; SizeX_mm: 1; SizeZ_mm: 0.6; TaMax_C: 85°C; TaMin_C: -55°C; U/M: EA; Value1: Unknown; Value2: 10V; RoHS: Y; AEC Grade: N/A; ComponentLink1Description: Datasheet link; ComponentLink1URL: http://www.samsungsem.com/kr/support/product-search/mlcc/__icsFiles/afieldfile/2018/06/21/CL05A106MP5NUNC.pdf; CompType: Capacitor; MountType: SMT; PackageReference: 0402; PartNumber: CL05A106MP5NUNC; Polarized: N; SizeY_mm: 0.5; Technology: Ceramic; TempCo: X5R; Tolerance_%: 20%; ValueDisplayed: 10uF; VDC_V: 10V
C11 C21 C24 C31 C42 = CMP-0009657-3: CAP, CERM, 2.2 uF, 6.3 V, +/- 20%, X5R, 0201; Manufacturer: Samsung Electro-Mechanics; AEC Category: Q200; Cap_Case: 0201; Cap_F: 2.2µF; Polarized: N; SizeArea_mm2: 0.18; SizeAreaWB_mm2: 2.08; SizeX_mm: 0.6; SizeY_mm: 0.3; SizeZ_mm: 0.26; TaMax_C: 85°C; TaMin_C: -55°C; U/M: EA; Value1: Unknown; Value2: 6.3V; RoHS: Y; AEC Qualified: ?; ComponentLink1Description: Datasheet link; ComponentLink1URL: http://www.samsungsem.com/servlet/FileDownload?type=spec&file=CL03A225MQ3CRNC.pdf; CompType: Capacitor; MountType: SMT; PackageReference: 0201; PartNumber: CL03A225MQ3CRNC; Technology: Ceramic; TempCo: X5R; Tolerance_%: 20%; ValueDisplayed: 2.2uF; VDC_V: 6.3V; LatestRevisionDate: 2017-03-09; Published: 2008-06-19; Publisher: Texas Instruments
C13 C14 C16-C18 C23 C25-C29 C32-C38 C41 C44-C47 = CMP-0009781-1: CAP, CERM, 0.22 uF, 10 V, +/- 20%, X5R, 0201; Manufacturer: Taiyo Yuden; AEC Category: Q200; AEC Qualified: N; Cap_Case: 0201; Cap_F: 220nF; SizeArea_mm2: 0.18; SizeAreaWB_mm2: 2.08; SizeX_mm: 0.6; SizeY_mm: 0.3; SizeZ_mm: 0.33; TaMax_C: 85°C; TaMin_C: -55°C; U/M: EA; Value1: Unknown; Value2: 10V; RoHS: Y; AEC Grade: N/A; ComponentLink1Description: Datasheet link; ComponentLink1URL: http://www.yuden.co.jp/productdata/catalog/en/mlcc_all_e.pdf; CompType: Capacitor; LatestRevisionDate: 2017-03-09; MountType: SMT; PackageReference: 0201; PartNumber: LMK063BJ224MP-F; Polarized: N; Published: 2008-06-19; Publisher: Texas Instruments; Supplier 1: Digi-Key; Supplier 2: Newark; Supplier 3: Mouser; Supplier Part Number 1: 587-2483-1-ND; Supplier Part Number 2: 48T3327; Supplier Part Number 3: 963-LMK063BJ224MP-F; Technology: Ceramic; TempCo: X5R; Tolerance_%: 20%; ValueDisplayed: 0.22uF; VDC_V: 10V
C15 C20 = CMP-0086440-1: as C67 on sheet Qunyin_mmWave_mainIOs; RoHS: TRUE; ComponentLink1Description: Datasheet; ComponentLink1URL: https://search.murata.co.jp/Ceramy/image/img/A01X/G101/ENG/GRM033R6YA104KE14-01.pdf; PackageReference: 0201 (0603 Metric); PartNumber: GRM033R6YA104KE14D; Tolerance_%: 10%; VDC_V: 35V
C43 C48 = CMP-0081763-1: CAP, CERM, 1 µF, 6.3 V,+/- 10%, X6S, 0402; Manufacturer: TDK; TaMin_C: -55°C; Polarized: N; SizeAreaWB_mm2: 3; U/M: EA; Value: 1uF; TaMax_C: 105°C; SizeZ_mm: 0.6; SizeX_mm: 1; SizeY_mm: 0.5; Cap_Case: 0402; Value2: 6.3V; CompType: Capacitor; AEC Category: Q200; ComponentLink1URL: https://product.tdk.com/info/en/catalog/datasheets/mlcc_commercial_lowprofile_en.pdf; Supplier Part Number 2: 810-CGB2A1X6S0J105KC; Supplier 2: Mouser; TempCo: X6S; RoHS: Y; MountType: SMT; Supplier 1: Digi-Key; PackageReference: 0402; Tolerance_%: 10%; SizeArea_mm2: 0.5; PartNumber: CGB2A1X6S0J105K033BC; AEC Qualified: N; Cap_F: 1µF; VDC_V: 6.3V; ComponentLink1Description: Datasheet link; AEC Grade: N/A; Supplier Part Number 1: 445-13189-1-ND; Technology: Ceramic
FL2 FL3 = CMP-0078934-1: as FL9 on sheet Qunyin_mmWave_mainIOs; RoHS: Y; ComponentLink1Description: Datasheet link; ComponentLink1URL: https://www.murata.com/en-us/products/productdata/8796748677150/QNFA9118.pdf; CompType: Inductor; LatestRevisionDate: 2017-12-07; Material: Ferrite; MountType: SMT; PackageReference: 0402; PartNumber: BLM15PD300SZ1D; Published: 2008-06-26; Publisher: Texas Instruments; SizeX_mm: 1; SizeY_mm: 0.5; Supplier 1: Digi-Key; Supplier 2: Mouser; Supplier Part Number 1: 490-16506-1-ND; Supplier Part Number 2: 81-BLM15PD300SZ1D; Technology: Ferrite Bead; Value1: 0.035 ohm; Value2: 2.2A
TP2 = CMP-0078143-3: TEST POINT.  No entry in BOM.; CompType: Testpoint; Manufacturer: N/A; PackageReference: N/A; PartNumber: N/A; Library Reference: TESTPOINT
U3 = CMP-0860942-2: as U3 on sheet Qunyin_mmWave_mainIOs; MountType: SMT; ComponentLink2URL: http://www.ti.com/product/xi6843arqg; Alternate Manufacturer: Texas Instruments; ComponentLink2Description: Product Folder; ComponentLink3Description: Online Datasheet; PackageReference: ALP0180A; ComponentLink1URL: http://www.ti.com/lit/ds/symlink/xi6843arqg.pdf; PartNumber: XI6843ARQGALP; PackageDescription: BGA-180; ComponentLink1Description: Datasheet Link; ComponentLink3URL: http://www.ti.com/product/xi6843arqg/datasheet; SizeY_mm: 15

## Sheet Qunyin_mmWave_pmic.SchDoc: mmWave_iwr6843aop
size 457 x 292 mm; DrawnBy: Wxd; Organization: Shanghai Qunyin; Address1: Xianxia Rd 601; Address2: Changning district; Address3: Shanghai; DocumentNumber: 3; SheetNumber: 3; SheetTotal: 6
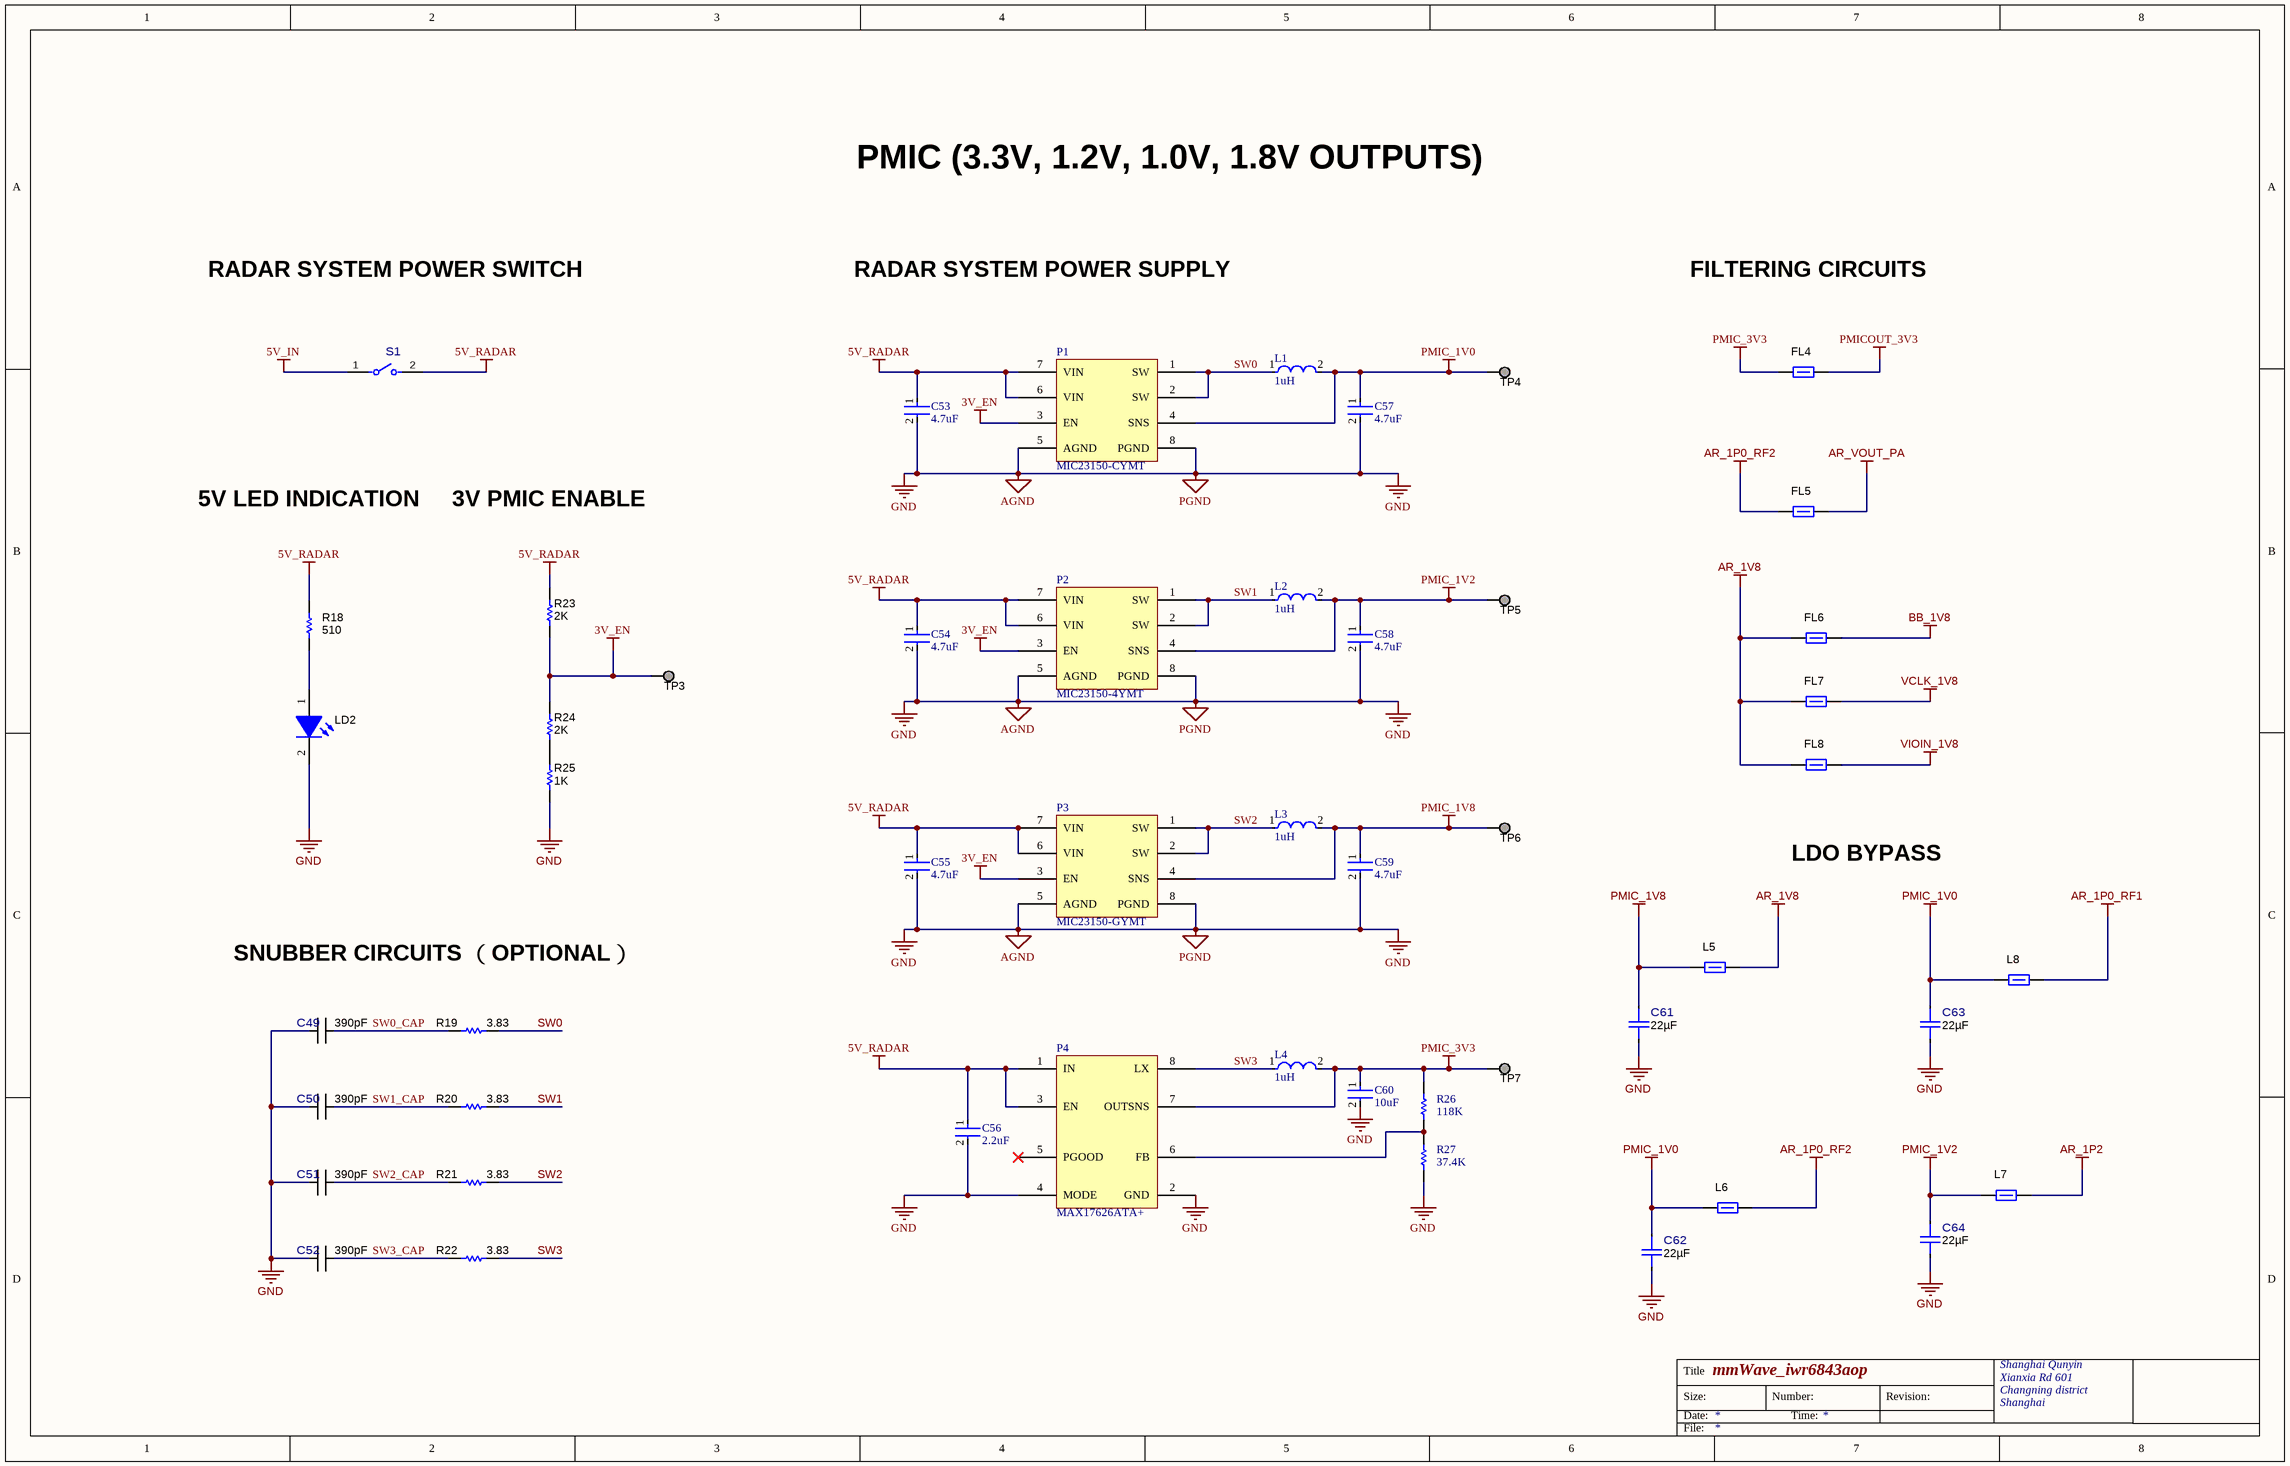
[diagram p2: Qunyin_mmWave_pmic.SchDoc]

### Parts
C49  Cap_F: 390pF  [FP-TMK063CG391JT-F_0201 (0603 Metric)-IPC_C]  (hidden comment: TMK063CG391JT-F)
C50  Cap_F: 390pF  [FP-TMK063CG391JT-F_0201 (0603 Metric)-IPC_C]  (hidden comment: TMK063CG391JT-F)
C51  Cap_F: 390pF  [FP-TMK063CG391JT-F_0201 (0603 Metric)-IPC_C]  (hidden comment: TMK063CG391JT-F)
C52  Cap_F: 390pF  [FP-TMK063CG391JT-F_0201 (0603 Metric)-IPC_C]  (hidden comment: TMK063CG391JT-F)
C53  Capacitance: 4.7uF  [FP-CL10-IPC_C]  (hidden comment: CL10B475KQ8NQNC)
C54  Capacitance: 4.7uF  [FP-CL10-IPC_C]  (hidden comment: CL10B475KQ8NQNC)
C55  Capacitance: 4.7uF  [FP-CL10-IPC_C]  (hidden comment: CL10B475KQ8NQNC)
C56  Capacitance: 2.2uF  [FP-GRM188-0_1-e0_2_0_5-MFG]  (hidden comment: GRM188R71A225KE15D)
C57  Capacitance: 4.7uF  [FP-CL10-IPC_C]  (hidden comment: CL10B475KQ8NQNC)
C58  Capacitance: 4.7uF  [FP-CL10-IPC_C]  (hidden comment: CL10B475KQ8NQNC)
C59  Capacitance: 4.7uF  [FP-CL10-IPC_C]  (hidden comment: CL10B475KQ8NQNC)
C60  capacitance: 10uF  [FP-GRM188-0_2-IPC_C]  (hidden comment: GRM188Z71A106KA73D)
C61  Cap_F: 22µF  [FP-CL05A226MQ5N6J8_0402-IPC_C]  (hidden comment: CL05A226MQ5N6J8)
C62  Cap_F: 22µF  [FP-CL05A226MQ5N6J8_0402-IPC_C]  (hidden comment: CL05A226MQ5N6J8)
C63  Cap_F: 22µF  [FP-CL05A226MQ5N6J8_0402-IPC_C]  (hidden comment: CL05A226MQ5N6J8)
C64  Cap_F: 22µF  [FP-CL05A226MQ5N6J8_0402-IPC_C]  (hidden comment: CL05A226MQ5N6J8)
FL4  BLM15PD300SZ1D  [0402L]  (value not drawn)
FL5  BLM15PD300SZ1D  [0402L]  (value not drawn)
FL6  BLM15PD300SZ1D  [0402L]  (value not drawn)
FL7  BLM15PD300SZ1D  [0402L]  (value not drawn)
FL8  BLM15PD300SZ1D  [0402L]  (value not drawn)
L1  Inductance: 1uH  [FP-LQH5BPB_T0-MFG]  (hidden comment: LQH5BPN1R0NT0L)
L2  Inductance: 1uH  [FP-LQH5BPB_T0-MFG]  (hidden comment: LQH5BPN1R0NT0L)
L3  Inductance: 1uH  [FP-LQH5BPB_T0-MFG]  (hidden comment: LQH5BPN1R0NT0L)
L4  Inductance: 1uH  [FP-LQH5BPB_T0-MFG]  (hidden comment: LQH5BPN1R0NT0L)
L5  BLM18SG260TN1D  [0603L]  (value not drawn)
L6  BLM18SG260TN1D  [0603L]  (value not drawn)
L7  BLM18SG260TN1D  [0603L]  (value not drawn)
L8  BLM18SG260TN1D  [0603L]  (value not drawn)
LD2  APHHS1005CGCK  [APHHS1005_Green]  (value not drawn)
P1  MIC23150-CYMT
P2  MIC23150-4YMT
P3  MIC23150-GYMT
P4  MAX17626ATA+
R18  value 510  [0201L]  (hidden comment: RC0201JR-07510RL)
R19  Res_ohm: 3.83  [FP-RC0402FR-073R83L_0402 (1005 Metric)-IPC_C]  (hidden comment: RC0402FR-073R83L)
R20  Res_ohm: 3.83  [FP-RC0402FR-073R83L_0402 (1005 Metric)-IPC_C]  (hidden comment: RC0402FR-073R83L)
R21  Res_ohm: 3.83  [FP-RC0402FR-073R83L_0402 (1005 Metric)-IPC_C]  (hidden comment: RC0402FR-073R83L)
R22  Res_ohm: 3.83  [FP-RC0402FR-073R83L_0402 (1005 Metric)-IPC_C]  (hidden comment: RC0402FR-073R83L)
R23  value 2K  [FP-RMCF0603-IPC_A]  (hidden comment: Stackpole Electronics RMCF0603FT2K00)
R24  value 2K  [FP-RMCF0603-IPC_A]  (hidden comment: Stackpole Electronics RMCF0603FT2K00)
R25  value 1K  [FP-RMCF0603-IPC_A]  (hidden comment: Samsung RC0603J102CS)
R26  value 118K  [FP-CRCW1206-e3-IPC_A]  (hidden comment: Vishay CRCW1206118KFKEA)
R27  value 37.4K  [FP-CRCW1206-e3-IPC_A]  (hidden comment: Panasonic ERJ-8ENF3742V)
S1  CHS-01TA  [FP-CHS-01TA_SMT_SW_5MM4_2MM5-MFG]  (value not drawn)
TP3  TESTPOINT  [TP_25MIL-SMT]  (value not drawn)  (no BOM)
TP4  TESTPOINT  [TP_25MIL-SMT]  (value not drawn)  (no BOM)
TP5  TESTPOINT  [TP_25MIL-SMT]  (value not drawn)  (no BOM)
TP6  TESTPOINT  [TP_25MIL-SMT]  (value not drawn)  (no BOM)
TP7  TESTPOINT  [TP_25MIL-SMT]  (value not drawn)  (no BOM)

### Nets
3V_EN: P1.3(EN) P2.3(EN) P3.3(EN) R23.1 R24.2 TP3.1
5V_IN: S1.1
5V_RADAR: C53.1 C54.1 C55.1 C56.1 P1.6(VIN) P1.7(VIN) P2.6(VIN) P2.7(VIN) P3.6(VIN) P3.7(VIN) P4.1(IN) P4.3(EN) R18.1 R23.2 S1.2
AGND: C49.2 C50.2 C51.2 C52.2 C53.2 C54.2 C55.2 C56.2 C57.2 C58.2 C59.2 C60.2 C61.2 C62.2 C63.2 C64.2 LD2.2(K) P1.5(AGND) P1.8(PGND) P2.5(AGND) P2.8(PGND) P3.5(AGND) P3.8(PGND) P4.2(GND) P4.4(MODE) R25.1 R27.1  [also labelled GND, PGND]
AR_1P0_RF1: L8.2
AR_1P0_RF2: FL5.1 L6.2
AR_1P2: L7.2
AR_1V8: FL6.1 FL7.1 FL8.1 L5.2
AR_VOUT_PA: FL5.2
BB_1V8: FL6.2
PMIC_1V0: C57.1 C62.1 C63.1 L1.2 L6.1 L8.1 P1.4(SNS) TP4.1
PMIC_1V2: C58.1 C64.1 L2.2 L7.1 P2.4(SNS) TP5.1
PMIC_1V8: C59.1 C61.1 L3.2 L5.1 P3.4(SNS) TP6.1
PMIC_3V3: C60.1 FL4.1 L4.2 P4.7(OUTSNS) R26.2 TP7.1
PMICOUT_3V3: FL4.2
VCLK_1V8: FL7.2
VIOIN_1V8: FL8.2
SW0: L1.1 P1.1(SW) P1.2(SW) R19.2
SW0_CAP: C49.1 R19.1
SW1: L2.1 P2.1(SW) P2.2(SW) R20.2
SW1_CAP: C50.1 R20.1
SW2: L3.1 P3.1(SW) P3.2(SW) R21.2
SW2_CAP: C51.1 R21.1
SW3: L4.1 P4.8(LX) R22.2
SW3_CAP: C52.1 R22.1
NetLD2_1: LD2.1(A) R18.2
NetP4_6: P4.6(FB) R26.1 R27.2
NetR24_1: R24.1 R25.2

Not connected (* = marked no-connect by the designer): P4 5(PGOOD)*

### Notes on the sheet
- PMIC (3.3V, 1.2V, 1.0V, 1.8V OUTPUTS)
- RADAR SYSTEM POWER SWITCH
- RADAR SYSTEM POWER SUPPLY
- FILTERING CIRCUITS
- 5V LED INDICATION
- 3V PMIC ENABLE
- LDO BYPASS
- SNUBBER CIRCUITS （OPTIONAL）
- Title
- Size:
- Date:
- Number:
- Time:
- Revision:
- File:

### Library data of the parts
C49-C52 = CMP-0086438-1: CAP CER 390PF 25V C0G/NP0 0201; Manufacturer: Taiyo Yuden; AEC Qualified: No; SizeZ_mm: 0.33mm; Symbol Name: SYM-TMK063CG391JT-F; TempCo: 30ppm/°C; Tolerance_%: 5%; RoHS: TRUE; ComponentLink1Description: Datasheet; ComponentLink1URL: https://ds.yuden.co.jp/TYCOMPAS/ut/download?pn=TMK063CG391JT-F+&fileType=CA; PackageReference: 0201 (0603 Metric); PartNumber: TMK063CG391JT-F; VDC_V: 25V
C53-C55 C57-C59 = CMP-2000-06096-2: CAP CER 4.7UF 6.3V X7R 0603; Manufacturer: Samsung; Tolerance: 10%; Material: Ceramic; Temperature Coefficient: 15%; Device Class L3: Ceramic Capacitors; Temperature Characteristic: X7R; Automotive: No; Package: CL10; Device Class L2: Capacitors; Octopart: https://octopart.com/cl10b475kq8nqnc-samsung-24957976; ComponentLink2Description: Datasheet; Temperature Range High: +125°C; Lead Free: Yes; Height: 0.95mm; Temperature: -55°C to +125°C; Ipc Land Pattern Name: CAPC16080X80; Temperature Range Low: -55°C; Digikey Description: CAP CER 4.7UF 6.3V X7R 0603; Mouser Description: C Series 0402 4.7 uF 6.3 V ±20 % Tolerance X5R SMT Multilayer Ceramic Capacitor; Category: Cap; ComponentLink2URL: http://www.samsungsem.com/kr/support/product-search/mlcc/__icsFiles/afieldfile/2018/07/24/CL10B475KQ8NQNC.pdf; Value: 4.7uF; Voltage Rating: 6.3V; Manufacturer Part Number: CL10B475KQ8NQNC; Device Class L1: Passive Components; RoHS: TRUE
C56 = CMP-2006-02836-2: Chip Multilayer Ceramic Capacitors for General Purpose, 0603, 2.2uF, X7R, 15%, 10%, 10V; Case Code (Metric): 1608; Height: 0.8mm; Packaging: Cut Tape; Voltage: 10V; Lead Free: Lead Free; Min Operating Temperature: -55°C; Voltage Rating (DC): 10V; Max Operating Temperature: 125°C; Voltage Rating: 10V; Dielectric: X7R; Depth: 0.8mm; Case Code (Imperial): 0603; Termination: SMD/SMT; Case/Package: 0603; Number of Pins: 2; REACH SVHC: No SVHC; Mount: Surface Mount; Width: 0.031inch; Material: Ceramic; Package Quantity: 1; Weight: 7.1E-05oz; Length: 1.6mm; Thickness: 0.035inch; Tolerance: 10%
C60 = CMP-06035-000049-2: Chip Multilayer Ceramic Capacitors for General Purpose, 0603, 10uF, X7R, 15%, 10%, 10V
C61-C64 = CMP-0089043-3: CAP CER 22UF 6.3V X5R 0402; Manufacturer: Samsung Electro-Mechanics; TempCo: 15%; AEC Qualified: No; Tolerance_%: 20%; SizeZ_mm: 0.55mm; ComponentLink1URL: http://www.samsungsem.com/kr/support/library/product-catalog/__icsFiles/afieldfile/2018/11/28/MLCC.pdf; RoHS: TRUE; PartNumber: CL05A226MQ5N6J8; ComponentLink1Description: Datasheet; PackageReference: 0402; VDC_V: 6.3V; ValueDisplayed: 22uF; Part Number: CL05A226MQ5N6J8
FL4-FL8 = CMP-0078934-1: as FL9 on sheet Qunyin_mmWave_mainIOs; RoHS: Y; ComponentLink1Description: Datasheet link; ComponentLink1URL: https://www.murata.com/en-us/products/productdata/8796748677150/QNFA9118.pdf; CompType: Inductor; LatestRevisionDate: 2017-12-07; Material: Ferrite; MountType: SMT; PackageReference: 0402; PartNumber: BLM15PD300SZ1D; Published: 2008-06-26; Publisher: Texas Instruments; SizeX_mm: 1; SizeY_mm: 0.5; Supplier 1: Digi-Key; Supplier 2: Mouser; Supplier Part Number 1: 490-16506-1-ND; Supplier Part Number 2: 81-BLM15PD300SZ1D; Technology: Ferrite Bead; Value1: 0.035 ohm; Value2: 2.2A
L1-L4 = CMP-06042-011330-1: Wire Wound Ferrite Inductor for Power Lines 1μH ±30% 0.0228Ω 3.1A 2020; Max DC Current: 5.8A; Test Frequency: 100kHz; Self Resonant Frequency: 90MHz; Shielding: Shielded; DC Resistance (DCR): 19mR; Tolerance: 30%; Resistor Type: Wirewound; Max Operating Temperature: 85°C; Inductance Tolerance: 30%; Case/Package: 2020; Lead Free: Lead Free; Mount: Surface Mount; Core Material: Ferrite; Military Standard: Not; Termination: SMD/SMT; Case Code (Imperial): 2020; Min Operating Temperature: -40°C; Length: 0.197inch; Package Quantity: 500; Height - Seated (Max): 0.086inch; Height: 2mm; Case Code (Metric): 5050; Width: 0.197inch; Depth: 5.2mm; REACH SVHC: No SVHC; Saturation Current: 5.8A; Packaging: Tape and Reel; Current Rating: 3.1A; DC Current: 3.1A
  L1: Parameter 1: *
L5-L8 = CMP-0003354-2: Ferrite Bead, 26 ohm @ 100 MHz, 6 A, 0603; Manufacturer: MuRata; ZTyp@100MHz_Ohm: 26; SizeAreaWB_mm2: 4.68; DCR_ohm: 7m; Value1: 0.007 ohm; Value: 26 ohm; Imax_A: 6A; SizeZ_mm: 1; SizeX_mm: 1.6; SizeY_mm: 0.8; SizeArea_mm2: 1.28; ComponentLink1URL: http://search.murata.co.jp/Ceramy/image/img/PDF/ENG/L0110S0100BLM18S.pdf; Supplier Part Number 2: 73M9124; Publisher: Texas Instruments; Supplier 2: Newark; Supplier Part Number 3: 81-BLM18SG260TN1D; Supplier 3: Mouser; Published: 2014-04-30; RoHS: Y; MountType: SMT; Supplier 1: Digi-Key; PackageReference: 0603; Value2: 6A; CompType: Ferrite Bead; LatestRevisionDate: 2017-03-09; PartNumber: BLM18SG260TN1D; ComponentLink1Description: Datasheet link; Supplier Part Number 1: 490-3995-1-ND; ValueDisplayed: 26 ohm
LD2 = CMP-0067682-2: as LD3 on sheet Qunyin_mmWave_mainIOs; RoHS: Y; Color: Green; ComponentLink1Description: Datasheet link; ComponentLink1URL: http://www.kingbrightusa.com/images/catalog/SPEC/APHHS1005CGCK.pdf; PackageReference: 0402; PartNumber: APHHS1005CGCK; CompType: LED; MountType: SMT; SizeY_mm: 0.5; Type: ?; Value2: 2.1V; Value: Green
P1 = MIC23150-CYMT: pmic 1V 2A 4MHz
P2 = MIC23150-4YMT: pmic 1.2V 2A 4MHz
P3 = MIC23150-GYMT: pmic 1.8V 2A 4MHz
P4 = MAX17626: IC 3.3V Adj Out Dc-dc Tdfn; Manufacturer: Analog Devices; Supplier 1: DigiKey; Supplier Part Number 1: 175-MAX17626ATA+-ND; Manufacturer Part Number: MAX17626ATA+
R18 = CMP-0027137-1: as R40 on sheet Qunyin_mmWave_mainIOs; RoHS: Y; AEC Grade: N/A; ComponentLink1Description: Datasheet link; ComponentLink1URL: http://www.yageo.com/documents/recent/PYu-RC_Group_51_RoHS_L_5.pdf; CompType: Resistor; LatestRevisionDate: 2017-03-09; MountType: SMT; PackageReference: 0201; PartNumber: RC0201JR-07510RL; Published: 2016-10-14; Publisher: Texas Instruments; Res_ohm: 510; Supplier 1: Digi-Key; Supplier 2: Mouser; Supplier Part Number 1: YAG2907CT-ND; Supplier Part Number 2: 603-RC0201JR-07510RL; Technology: Thick Film; Tolerance_%: 5%; Value1: 5%; ValueDisplayed: 510
R19-R22 = CMP-0086444-2: RES Thick Film SMD 3.83Ω 1% 1/16W 0402 200ppm/°C; Manufacturer: Yageo; AEC Qualified: No; Power_W: 63mW; VDC_V: 50V; SizeZ_mm: 0.4mm; ComponentLink1Description: Datasheet; PackageReference: 0402 (1005 Metric); TempCo: 200ppm/°C; RoHS: TRUE; Technology: Thick Film; PartNumber: RC0402FR-073R83L; ComponentLink1URL: http://www.yageo.com/documents/recent/PYu-RC_Group_51_RoHS_L_10.pdf; Tolerance_%: 1%
R23 R24 = Resistor: Res Thick Film 0603 2K Ohm 1% 0.1W(1/10W) ±100ppm/C Pad SMD Automotive T/R; Resistance: 2kR; Power Rating: 100mW; Temperature Coefficient: 100ppm/°C; Working Voltage: 75V; Supplier 1: Arrow Electronics; Supplier Part Number 1: RMCF0603FT2K00; Manufacturer: Stackpole Electronics; Manufacturer Part Number: RMCF0603FT2K00; RoHS: Yes; Category: Chip SMD Resistors; Stock 1: 210000; Pricing 1: 5000=0.00220, 10000=0.00210, 25000=0.00180 (USD); Mount: Surface Mount; Case/Package: 0603; Case Code (Metric): 1608; Case Code (Imperial): 0603; Contact Plating: Tin,Matte; Min Operating Temperature: -55°C; Max Operating Temperature: 155°C; Tolerance: 1%; Packaging: Tape and Reel; Resistor Type: Thick Film; Number of Terminations: 2; Max Power Dissipation: 100mW; Features: Automotive AEC-Q200; Series: RMCF; Technology: THICK FILM; Construction: Rectangular; Length: 1.55mm; Width: 0.031inch; Height: 0.022inch; Depth: 0.8mm; Radiation Hardening: No; Military Standard: Not; Lead Free: Lead Free; RoHS Compliant: Yes; ComponentLink1URL: https://datasheet.ciiva.com/15193/getdatasheetpartid-362041-15193463.pdf?src-supplier=Verical; ComponentLink1Description: https://datasheet.ciiva.com/15193/getdatasheetpartid-362041-15193463.pdf?src-supplier=Verical
R25 = Resistor: Res Thick Film 0201 1K Ohm 5% 0.05W(1/20W) ±250ppm/C Pad SMD T/R; Resistance: 1kR; Temperature Coefficient: 200ppm/°C; Power Rating: 50mW; Supplier 1: Arrow Electronics; Supplier Part Number 1: RC0603J102CS; Manufacturer: Samsung; Manufacturer Part Number: RC0603J102CS; RoHS: Yes; Category: Chip SMD Resistors; Stock 1: 11797; Pricing 1: 1=0.04340, 10=0.01620, 50=0.01600, 100=0.00940, 250=0.00640, 1000=0.00380, 3000=0.00350, 6000=0.00330 (USD); Case/Package: 0201; Contact Plating: Tin; Case Code (Metric): 0603; Case Code (Imperial): 0201; Size Code: 0201; Min Operating Temperature: -55°C; Max Operating Temperature: 125°C; Tolerance: 5%; Resistor Type: Thick Film; Packaging: Tape and Reel; Number of Terminations: 2; Max Power Dissipation: 50mW; Features: Moisture Resistant; Series: RC; Construction: Rectangular; Length: 0.024inch; Width: 0.012inch; Height: 0.01inch; Depth: 0.3mm; Radiation Hardening: No; Military Standard: Not; RoHS Compliant: Yes; ComponentLink1URL: https://datasheet.ciiva.com/26134/chip-resistor-150112-1-26134188.pdf?src-supplier=Digi-Key; ComponentLink1Description: https://datasheet.ciiva.com/26134/chip-resistor-150112-1-26134188.pdf?src-supplier=Digi-Key
R26 = Resistor: Res Thick Film 1206 118K Ohm 1% 1/4W ±100ppm/°C Molded SMD SMD Paper T/R; Power Rating: 250mW; Resistance: 118kR; Voltage Rating: 200V; Supplier 1: Newark; Supplier Part Number 1: 28W4162; Manufacturer: Vishay; Manufacturer Part Number: CRCW1206118KFKEA; RoHS: Yes; Category: Chip SMD Resistors; Stock 1: 283; Pricing 1: 10=0.09700, 25=0.07700, 50=0.05700, 100=0.03700 (USD); Case/Package: 1206; Number of Pins: 2; Case Code (Metric): 3216; Case Code (Imperial): 1206; Contact Plating: Tin; Weight: 0.000353oz; Size Code: 1206; Min Operating Temperature: -55°C; Max Operating Temperature: 155°C; Tolerance: 1%; Packaging: Tape and Reel; Resistor Type: Thick Film; Temperature Coefficient: 100ppm/°C; Series: CRCW; Number of Terminations: 2; Max Power Dissipation: 250mW; Voltage Rating (DC): 200V; Package Quantity: 10; Termination: SMD/SMT; Resistance Tolerance: 1%; Features: Automotive AEC-Q200; Construction: Rectangular; Length: 3.2mm; Width: 0.063inch; Height: 0.024inch; Depth: 1.6mm; Radiation Hardening: No; RoHS Compliant: Yes; REACH SVHC: Unknown; Lead Free: Lead Free; Military Standard: Not; ComponentLink1URL: https://datasheet.ciiva.com/5542/dcrcwe3-109170-5542060.pdf?src-supplier=Mouser; ComponentLink1Description: https://datasheet.ciiva.com/5542/dcrcwe3-109170-5542060.pdf?src-supplier=Mouser; ComponentLink2URL: https://datasheet.ciiva.com/8976/dcrcwe3-8976345.pdf?src-supplier=Avnet; ComponentLink2Description: https://datasheet.ciiva.com/8976/dcrcwe3-8976345.pdf?src-supplier=Avnet; ComponentLink3URL: https://datasheet.ciiva.com/2497/dcrcwe3-2497327.pdf?src-supplier=Digi-Key; ComponentLink3Description: https://datasheet.ciiva.com/2497/dcrcwe3-2497327.pdf?src-supplier=Digi-Key; ComponentLink4URL: https://datasheet.ciiva.com/2497/dcrcwe3-2497328.pdf?src-supplier=Digi-Key; ComponentLink4Description: https://datasheet.ciiva.com/2497/dcrcwe3-2497328.pdf?src-supplier=Digi-Key; ComponentLink5URL: https://datasheet.ciiva.com/2497/dcrcwe3-2497329.pdf?src-supplier=Digi-Key; ComponentLink5Description: https://datasheet.ciiva.com/2497/dcrcwe3-2497329.pdf?src-supplier=Digi-Key; ComponentLink6URL: https://datasheet.ciiva.com/7800/125364-7800553.pdf?src-supplier=Element14; ComponentLink6Description: https://datasheet.ciiva.com/7800/125364-7800553.pdf?src-supplier=Element14; ComponentLink7URL: https://datasheet.ciiva.com/22675/1847332-22675213.pdf?src-supplier=Element14; ComponentLink7Description: https://datasheet.ciiva.com/22675/1847332-22675213.pdf?src-supplier=Element14; ComponentLink8URL: https://datasheet.ciiva.com/7714/1697337-7714310.pdf?src-supplier=Element14; ComponentLink8Description: https://datasheet.ciiva.com/7714/1697337-7714310.pdf?src-supplier=Element14; ComponentLink9URL: https://datasheet.ciiva.com/7714/1697337-7714311.pdf?src-supplier=Element14; ComponentLink9Description: https://datasheet.ciiva.com/7714/1697337-7714311.pdf?src-supplier=Element14
R27 = Resistor: Res Thick Film 1206 37.4K Ohm 1% 1/4W ±100ppm/°C Molded SMD Punched Carrier T/R; Resistance: 37.4kR; Power Rating: 250mW; Voltage Rating (DC): 200V; Supplier 1: Arrow Electronics; Supplier Part Number 1: ERJ-8ENF3742V; Manufacturer: Panasonic; Manufacturer Part Number: ERJ-8ENF3742V; RoHS: Yes; Category: Chip SMD Resistors; Stock 1: 4646; Pricing 1: 1=0.05350, 10=0.02360, 100=0.01330, 500=0.01070, 1000=0.00720, 5000=0.00710 (USD); Mount: Surface Mount; Case/Package: 1206; Case Code (Metric): 3216; Case Code (Imperial): 1206; Contact Plating: Tin; Min Operating Temperature: -55°C; Max Operating Temperature: 155°C; Tolerance: 1%; Packaging: Tape and Reel; Temperature Coefficient: 100ppm/°C; Series: ERJ; Resistor Type: Thick Film; Voltage Rating: 200V; Number of Terminations: 2; Max Power Dissipation: 250mW; Package Quantity: 1; Features: Automotive AEC-Q200; Construction: Rectangular; Resistance Tolerance: 1%; Length: 3.2mm; Width: 0.063inch; Height: 0.028inch; Depth: 1.6mm; Radiation Hardening: No; RoHS Compliant: Yes; Lead Free: Lead Free; Military Standard: Not; REACH SVHC: Yes; ComponentLink1URL: https://datasheet.ciiva.com/22721/1678782-22721375.pdf?src-supplier=Farnell; ComponentLink1Description: https://datasheet.ciiva.com/22721/1678782-22721375.pdf?src-supplier=Farnell; ComponentLink2URL: https://datasheet.ciiva.com/22668/1678782-22668220.pdf?src-supplier=Element14; ComponentLink2Description: https://datasheet.ciiva.com/22668/1678782-22668220.pdf?src-supplier=Element14; ComponentLink3URL: https://datasheet.ciiva.com/22736/1678782-22736422.pdf?src-supplier=Element14; ComponentLink3Description: https://datasheet.ciiva.com/22736/1678782-22736422.pdf?src-supplier=Element14; ComponentLink4URL: https://datasheet.ciiva.com/46419/1678782-46419967.pdf?src-supplier=Element14; ComponentLink4Description: https://datasheet.ciiva.com/46419/1678782-46419967.pdf?src-supplier=Element14; ComponentLink5URL: https://datasheet.ciiva.com/24029/aoa0000ce2-24029820.pdf?src-supplier=Mouser; ComponentLink5Description: https://datasheet.ciiva.com/24029/aoa0000ce2-24029820.pdf?src-supplier=Mouser; ComponentLink6URL: https://datasheet.ciiva.com/9190/aoa0000ce2-9190159.pdf?src-supplier=Avnet; ComponentLink6Description: https://datasheet.ciiva.com/9190/aoa0000ce2-9190159.pdf?src-supplier=Avnet
S1 = CMP-0087181-1: as S2 on sheet Qunyin_mmWave_mainIOs; RoHS: TRUE; Circuit: SPST; ComponentLink1Description: Datasheet; ComponentLink1URL: https://www.nidec-copal-electronics.com/e/catalog/switch/chs.pdf; MountType: Surface Mount; PackageReference: SMT_SW_5MM4_2MM5; PartNumber: CHS-01TA; VDC_V: 6V
TP3-TP7 = CMP-0078143-3: TEST POINT.  No entry in BOM.; CompType: Testpoint; Manufacturer: N/A; PackageReference: N/A; PartNumber: N/A; Library Reference: TESTPOINT